# EAGLE design ZMinusSunSensorBoardAntennae (EAGLE 9.6.2)
DESIGNER: Thomas Christison; REV#: B; REVIEWER: ADCS Electrical

## Sheet 1 of 6
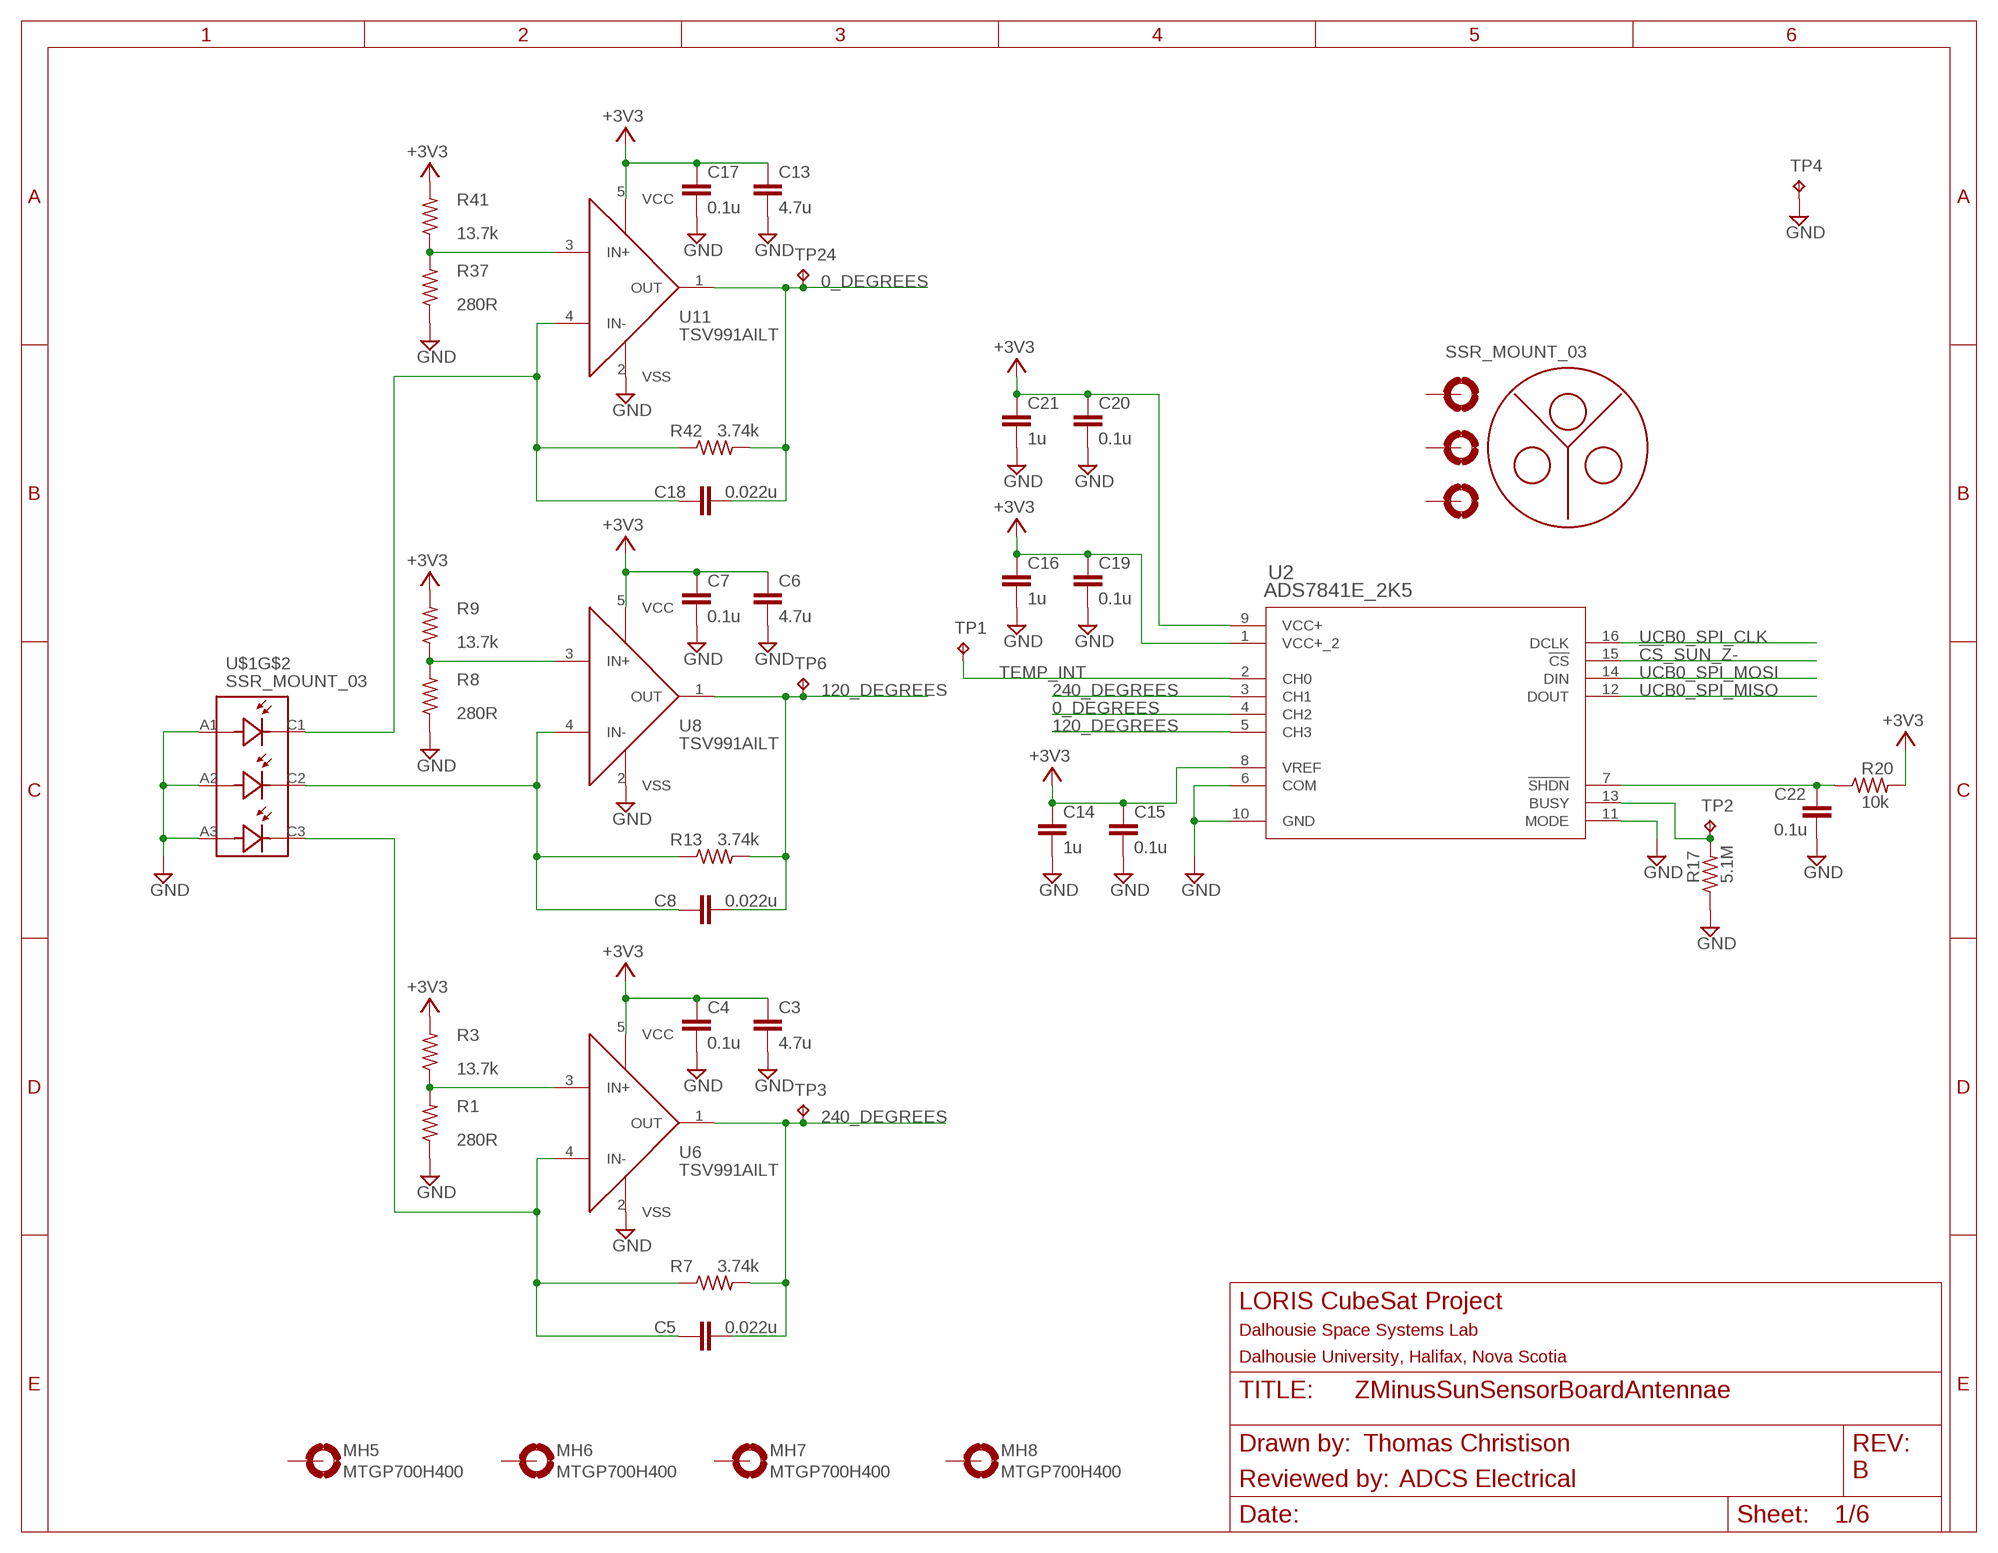
[diagram p0: schematic, sheet 1]

### Parts
C3  4.7u  C-EUC0805  [C0805]
C4  0.1u  C-EUC0402  [C0402]
C5  0.022u  C-EUC0402  [C0402]
C6  4.7u  C-EUC0805  [C0805]
C7  0.1u  C-EUC0402  [C0402]
C8  0.022u  C-EUC0402  [C0402]
C13  4.7u  C-EUC0805  [C0805]
C14  1u  C-EUC0402  [C0402]
C15  0.1u  C-EUC0402  [C0402]
C16  1u  C-EUC0402  [C0402]
C17  0.1u  C-EUC0402  [C0402]
C18  0.022u  C-EUC0402  [C0402]
C19  0.1u  C-EUC0402  [C0402]
C20  0.1u  C-EUC0402  [C0402]
C21  1u  C-EUC0402  [C0402]
C22  0.1u  C-EUC0402  [C0402]
MH5  MTGP700H400  [MTGP700H400]
MH6  MTGP700H400  [MTGP700H400]
MH7  MTGP700H400  [MTGP700H400]
MH8  MTGP700H400  [MTGP700H400]
R1  280R  R-US_R0402  [R0402]
R3  13.7k  R-US_R0402  [R0402]
R7  3.74k  R-US_R0402  [R0402]
R8  280R  R-US_R0402  [R0402]
R9  13.7k  R-US_R0402  [R0402]
R13  3.74k  R-US_R0402  [R0402]
R17  5.1M  R-US_R0402  [R0402]
R20  10k  R-US_R0402  [R0402]
R37  280R  R-US_R0402  [R0402]
R41  13.7k  R-US_R0402  [R0402]
R42  3.74k  R-US_R0402  [R0402]
TP1  TESTPOINT  [TP_P76H50]
TP2  TESTPOINT  [TP_P76H50]
TP3  TESTPOINT  [TP_P76H50]
TP4  TESTPOINT  [TP_P76H50]
TP6  TESTPOINT  [TP_P76H50]
TP24  TESTPOINT  [TP_P76H50]
U2  ADS7841E_2K5  [DBQ16]
U6  TSV991AILT  [SOT95P280X145-5N]
U8  TSV991AILT  [SOT95P280X145-5N]
U11  TSV991AILT  [SOT95P280X145-5N]
U$1  SSR_MOUNT_03  [SSR_MOUNT_03]

### Nets
0_DEGREES: C18.2 R42.2 TP24.1(TP) U2.4(CH2) U11.1(OUT)
120_DEGREES: C8.2 R13.2 TP6.1(TP) U2.5(CH3) U8.1(OUT)
240_DEGREES: C5.2 R7.2 TP3.1(TP) U2.3(CH1) U6.1(OUT)
!CS!_SUN_Z-: U2.15(!CS) ; also sheet 2
+3V3: C3.1 C4.1 C6.1 C7.1 C13.1 C14.1 C15.1 C16.1 C17.1 C19.1 C20.1 C21.1 R3.2 R9.2 R20.2 R41.2 U2.1(VCC+_2) U2.8(VREF) U2.9(VCC+) U6.5(VCC) U8.5(VCC) U11.5(VCC) ; also sheet 2,3,4,5,6
GND: C3.2 C4.2 C6.2 C7.2 C13.2 C14.2 C15.2 C16.2 C17.2 C19.2 C20.2 C21.2 C22.2 R1.1 R8.1 R17.1 R37.1 TP4.1(TP) U2.6(COM) U2.10(GND) U2.11(MODE) U6.2(VSS) U8.2(VSS) U11.2(VSS) U$1.A1 U$1.A2 U$1.A3 ; also sheet 2,3,4,5,6
N$2: R17.2 TP2.1(TP) U2.13(BUSY)
N$8: R1.2 R3.1 U6.3(IN+)
N$12: C5.1 R7.1 U6.4(IN-) U$1.C3
N$15: C22.1 R20.1 U2.7(!SHDN)
N$27: C8.1 R13.1 U8.4(IN-) U$1.C2
N$28: R8.2 R9.1 U8.3(IN+)
N$42: C18.1 R42.1 U11.4(IN-) U$1.C1
N$43: R37.2 R41.1 U11.3(IN+)
TEMP_INT: TP1.1(TP) U2.2(CH0) ; also sheet 2
UCB0_SPI_CLK: U2.16(DCLK) ; also sheet 2,3,4,5,6
UCB0_SPI_MISO: U2.12(DOUT) ; also sheet 2,3,4,5,6
UCB0_SPI_MOSI: U2.14(DIN) ; also sheet 2,3,4,5,6
Unconnected: MH5.1(MOUNT) MH6.1(MOUNT) MH7.1(MOUNT) MH8.1(MOUNT) U$1.1(MOUNT) U$1.2(MOUNT1) U$1.3(MOUNT2)

### Notes on the sheet
- Thomas Christison
- B
- ADCS Electrical

## Sheet 2 of 6
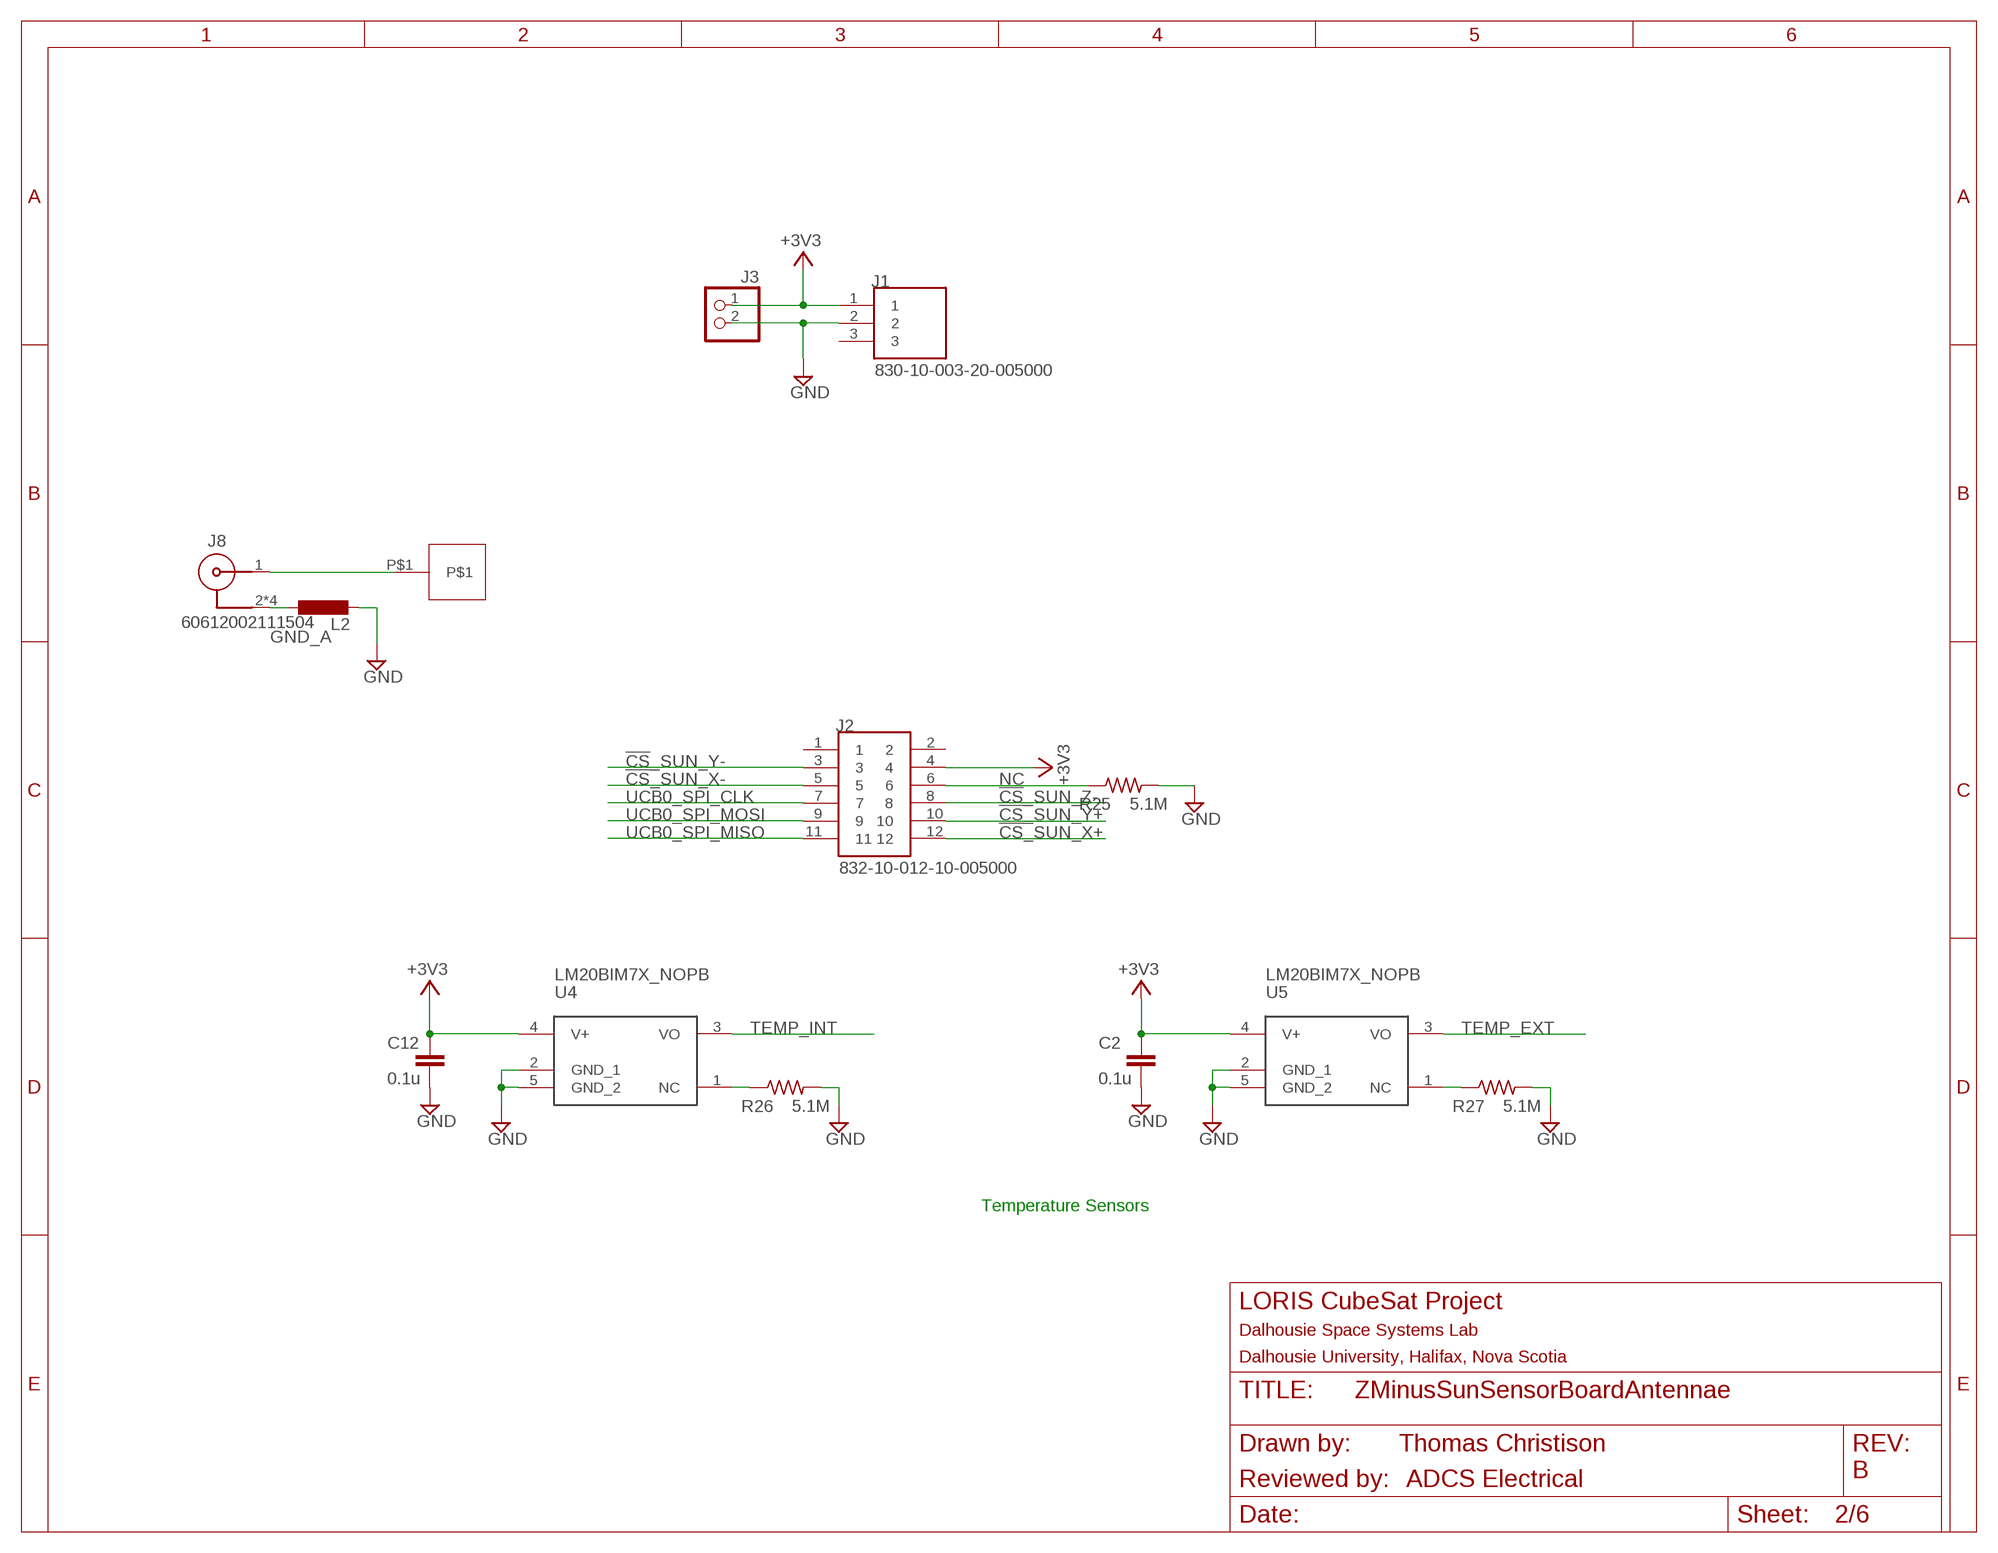
[diagram p1: schematic, sheet 2]

### Parts
C2  0.1u  C-EUC0402  [C0402]
C12  0.1u  C-EUC0402  [C0402]
J1  830-10-003-20-005000  [830-10-003-20-005000]
J2  832-10-012-10-005000  [832-10-012-10-005000]
J3  HDR_1X2_  [1X02]
J8  60612002111504  [60612002111504]
L2  L-EUL5650M  [L5650M]
R25  5.1M  R-US_R0402  [R0402]
R26  5.1M  R-US_R0402  [R0402]
R27  5.1M  R-US_R0402  [R0402]
U4  LM20BIM7X_NOPB  [SOT23-5P65_210X110L40X22N_LM20]
U5  LM20BIM7X_NOPB  [SOT23-5P65_210X110L40X22N_LM20]
U$2  2088900001  [2088900001]

### Nets
!CS!_SUN_X+: J2.12 ; also sheet 3
!CS!_SUN_X-: J2.5 ; also sheet 4
!CS!_SUN_Y+: J2.10 ; also sheet 5
!CS!_SUN_Y-: J2.3 ; also sheet 6
!CS!_SUN_Z-: J2.8 ; also sheet 1
+3V3: C2.1 C12.1 J1.1 J2.4 J3.1 U4.4(V+) U5.4(V+) ; also sheet 1,3,4,5,6
GND: C2.2 C12.2 J1.2 J3.2 L2.2 R25.2 R26.2 R27.2 U4.2(GND_1) U4.5(GND_2) U5.2(GND_1) U5.5(GND_2) ; also sheet 1,3,4,5,6
GND_A: J8.2 J8.3 J8.4 J8.5 L2.1
N$7: R26.1 U4.1(NC)
N$18: J8.1 U$2.P$1
N$20: R27.1 U5.1(NC)
N$67: J2.6 R25.1
TEMP_EXT: U5.3(VO) ; also sheet 3
TEMP_INT: U4.3(VO) ; also sheet 1
UCB0_SPI_CLK: J2.7 ; also sheet 1,3,4,5,6
UCB0_SPI_MISO: J2.11 ; also sheet 1,3,4,5,6
UCB0_SPI_MOSI: J2.9 ; also sheet 1,3,4,5,6
Unconnected: J1.3 J2.1 J2.2

### Notes on the sheet
- NC
- Temperature Sensors
- ADCS Electrical

## Sheet 3 of 6
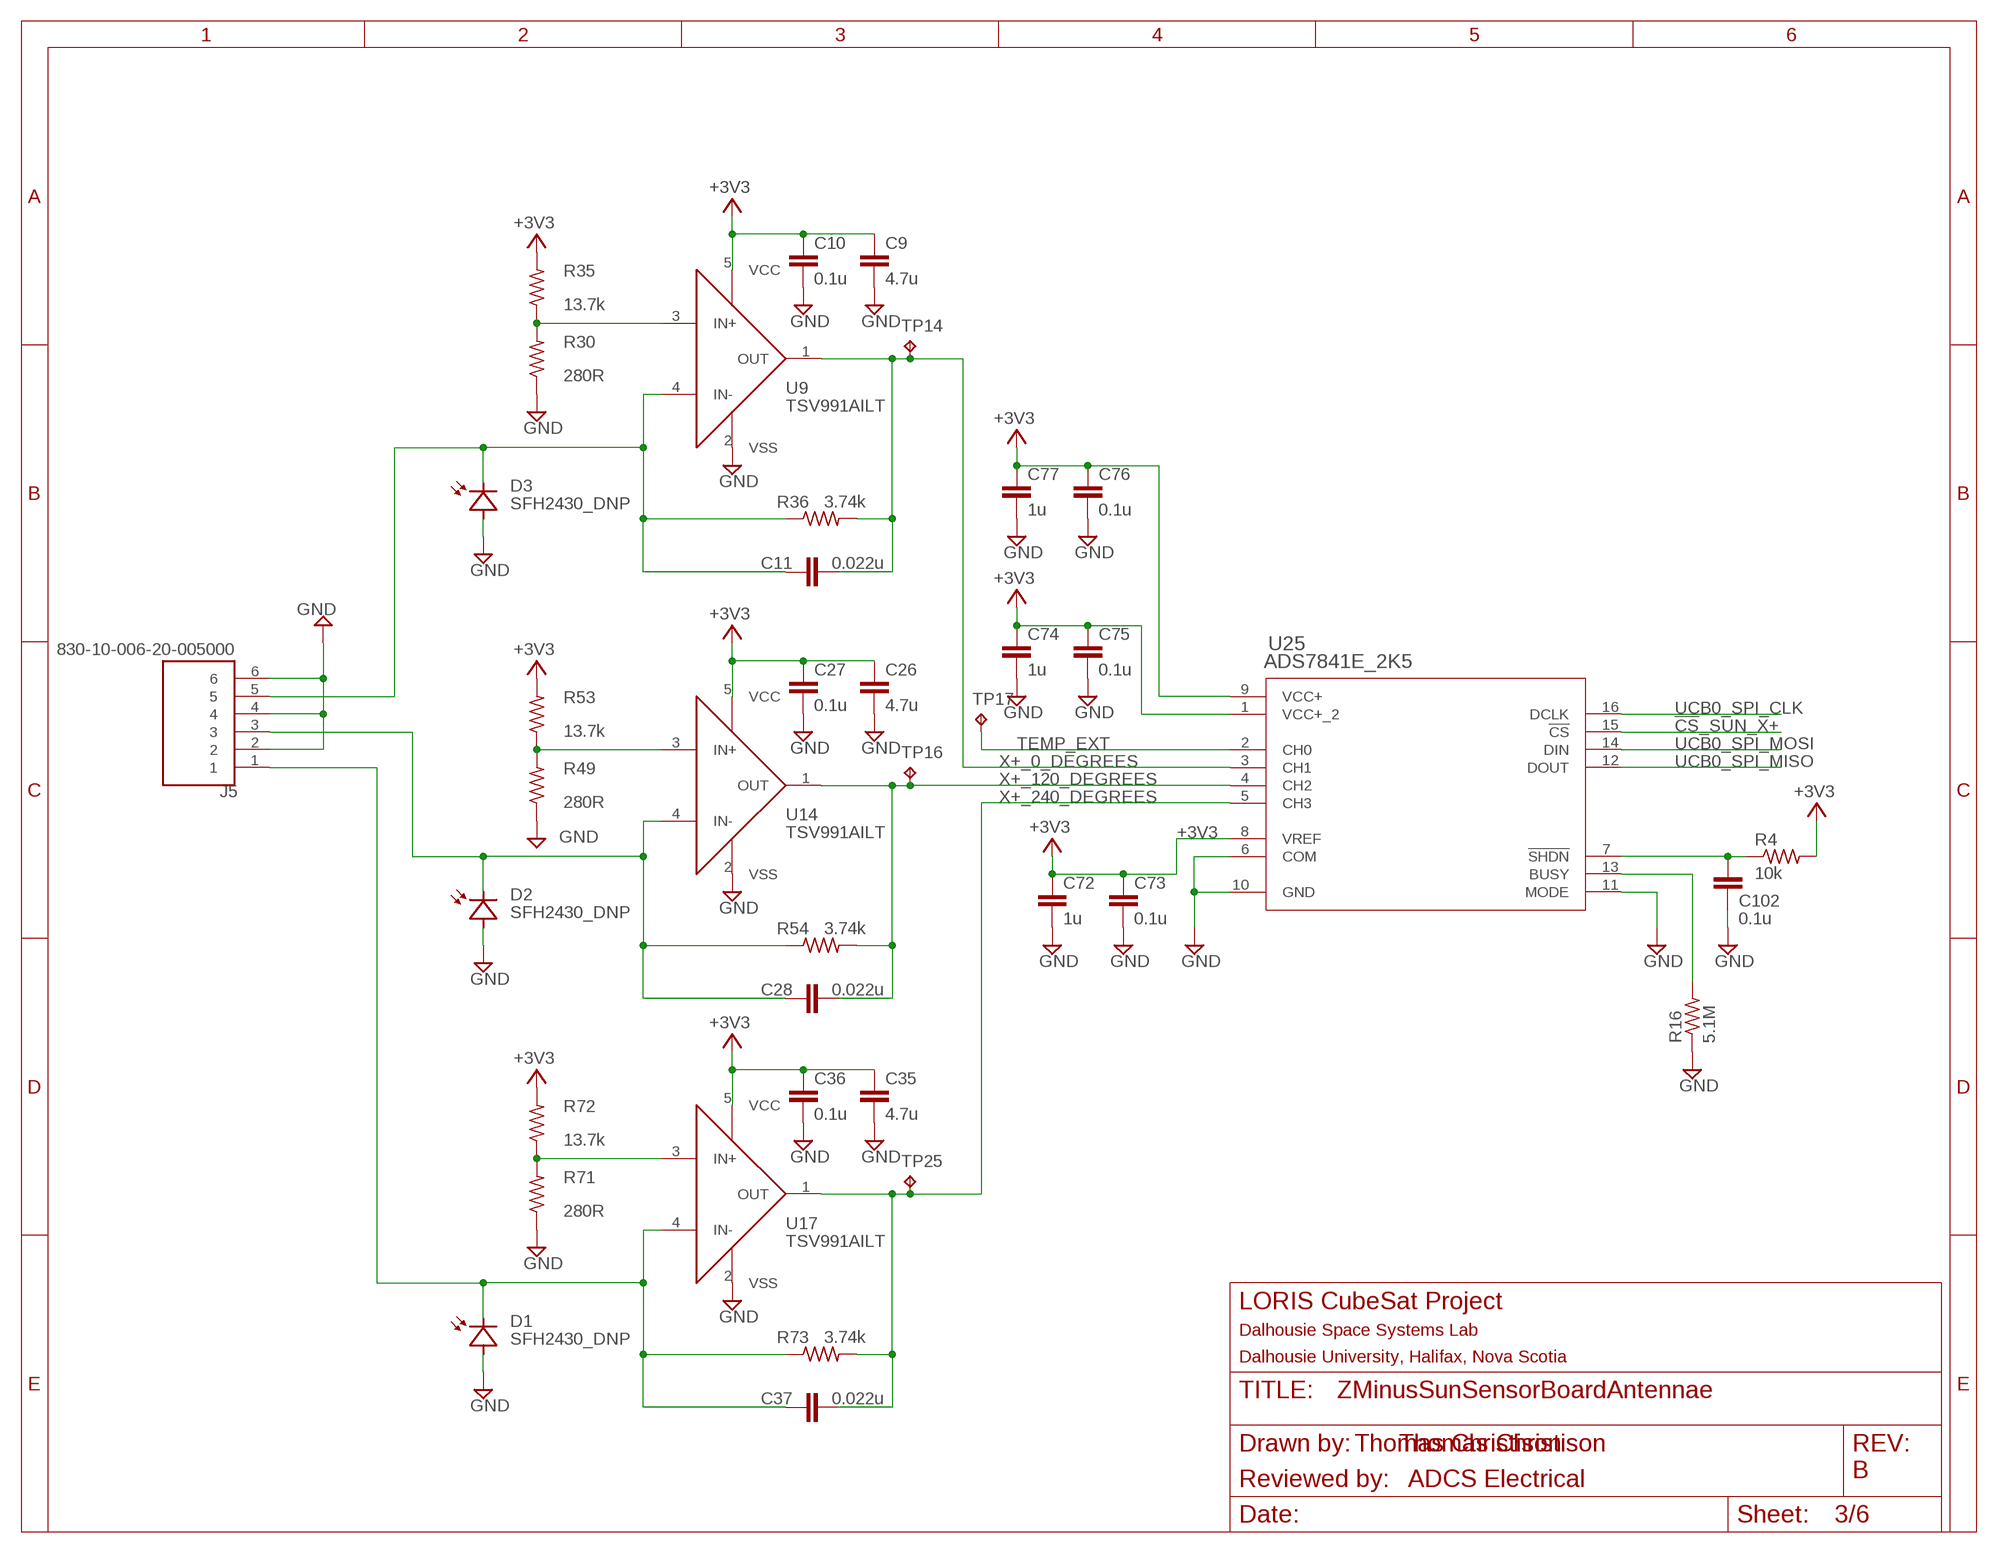
[diagram p2: schematic, sheet 3]

### Parts
C9  4.7u  C-EUC0805  [C0805]
C10  0.1u  C-EUC0402  [C0402]
C11  0.022u  C-EUC0402  [C0402]
C26  4.7u  C-EUC0805  [C0805]
C27  0.1u  C-EUC0402  [C0402]
C28  0.022u  C-EUC0402  [C0402]
C35  4.7u  C-EUC0805  [C0805]
C36  0.1u  C-EUC0402  [C0402]
C37  0.022u  C-EUC0402  [C0402]
C72  1u  C-EUC0402  [C0402]
C73  0.1u  C-EUC0402  [C0402]
C74  1u  C-EUC0402  [C0402]
C75  0.1u  C-EUC0402  [C0402]
C76  0.1u  C-EUC0402  [C0402]
C77  1u  C-EUC0402  [C0402]
C102  0.1u  C-EUC0402  [C0402]
J5  830-10-006-20-005000  [830-10-006-20-005000]
R4  10k  R-US_R0402  [R0402]
R16  5.1M  R-US_R0402  [R0402]
R30  280R  R-US_R0402  [R0402]
R35  13.7k  R-US_R0402  [R0402]
R36  3.74k  R-US_R0402  [R0402]
R49  280R  R-US_R0402  [R0402]
R53  13.7k  R-US_R0402  [R0402]
R54  3.74k  R-US_R0402  [R0402]
R71  280R  R-US_R0402  [R0402]
R72  13.7k  R-US_R0402  [R0402]
R73  3.74k  R-US_R0402  [R0402]
TP14  TESTPOINT  [TP_P76H50]
TP16  TESTPOINT  [TP_P76H50]
TP17  TESTPOINT  [TP_P76H50]
TP25  TESTPOINT  [TP_P76H50]
U9  TSV991AILT  [SOT95P280X145-5N]
U14  TSV991AILT  [SOT95P280X145-5N]
U17  TSV991AILT  [SOT95P280X145-5N]
U25  ADS7841E_2K5  [DBQ16]

### Nets
!CS!_SUN_X+: U25.15(!CS) ; also sheet 2
+3V3: C9.1 C10.1 C26.1 C27.1 C35.1 C36.1 C72.1 C73.1 C74.1 C75.1 C76.1 C77.1 R4.2 R35.2 R53.2 R72.2 U9.5(VCC) U14.5(VCC) U17.5(VCC) U25.1(VCC+_2) U25.8(VREF) U25.9(VCC+) ; also sheet 1,2,4,5,6
GND: C9.2 C10.2 C26.2 C27.2 C35.2 C36.2 C72.2 C73.2 C74.2 C75.2 C76.2 C77.2 C102.2 J5.2 J5.4 J5.6 R16.1 R30.1 R49.1 R71.1 U9.2(VSS) U14.2(VSS) U17.2(VSS) U25.6(COM) U25.10(GND) U25.11(MODE) ; also sheet 1,2,4,5,6
N$4: C102.1 R4.1 U25.7(!SHDN)
N$40: R30.2 R35.1 U9.3(IN+)
N$49: C11.1 J5.5 R36.1 U9.4(IN-)
N$51: R16.2 U25.13(BUSY)
N$55: C28.1 J5.3 R54.1 U14.4(IN-)
N$57: C37.1 J5.1 R73.1 U17.4(IN-)
N$60: R49.2 R53.1 U14.3(IN+)
N$71: R71.2 R72.1 U17.3(IN+)
TEMP_EXT: TP17.1(TP) U25.2(CH0) ; also sheet 2
UCB0_SPI_CLK: U25.16(DCLK) ; also sheet 1,2,4,5,6
UCB0_SPI_MISO: U25.12(DOUT) ; also sheet 1,2,4,5,6
UCB0_SPI_MOSI: U25.14(DIN) ; also sheet 1,2,4,5,6
X+_0_DEGREES: C11.2 R36.2 TP14.1(TP) U9.1(OUT) U25.3(CH1)
X+_120_DEGREES: C28.2 R54.2 TP16.1(TP) U14.1(OUT) U25.4(CH2)
X+_240_DEGREES: C37.2 R73.2 TP25.1(TP) U17.1(OUT) U25.5(CH3)

### Notes on the sheet
- Thomas Christison
- B
- ADCS Electrical

## Sheet 4 of 6
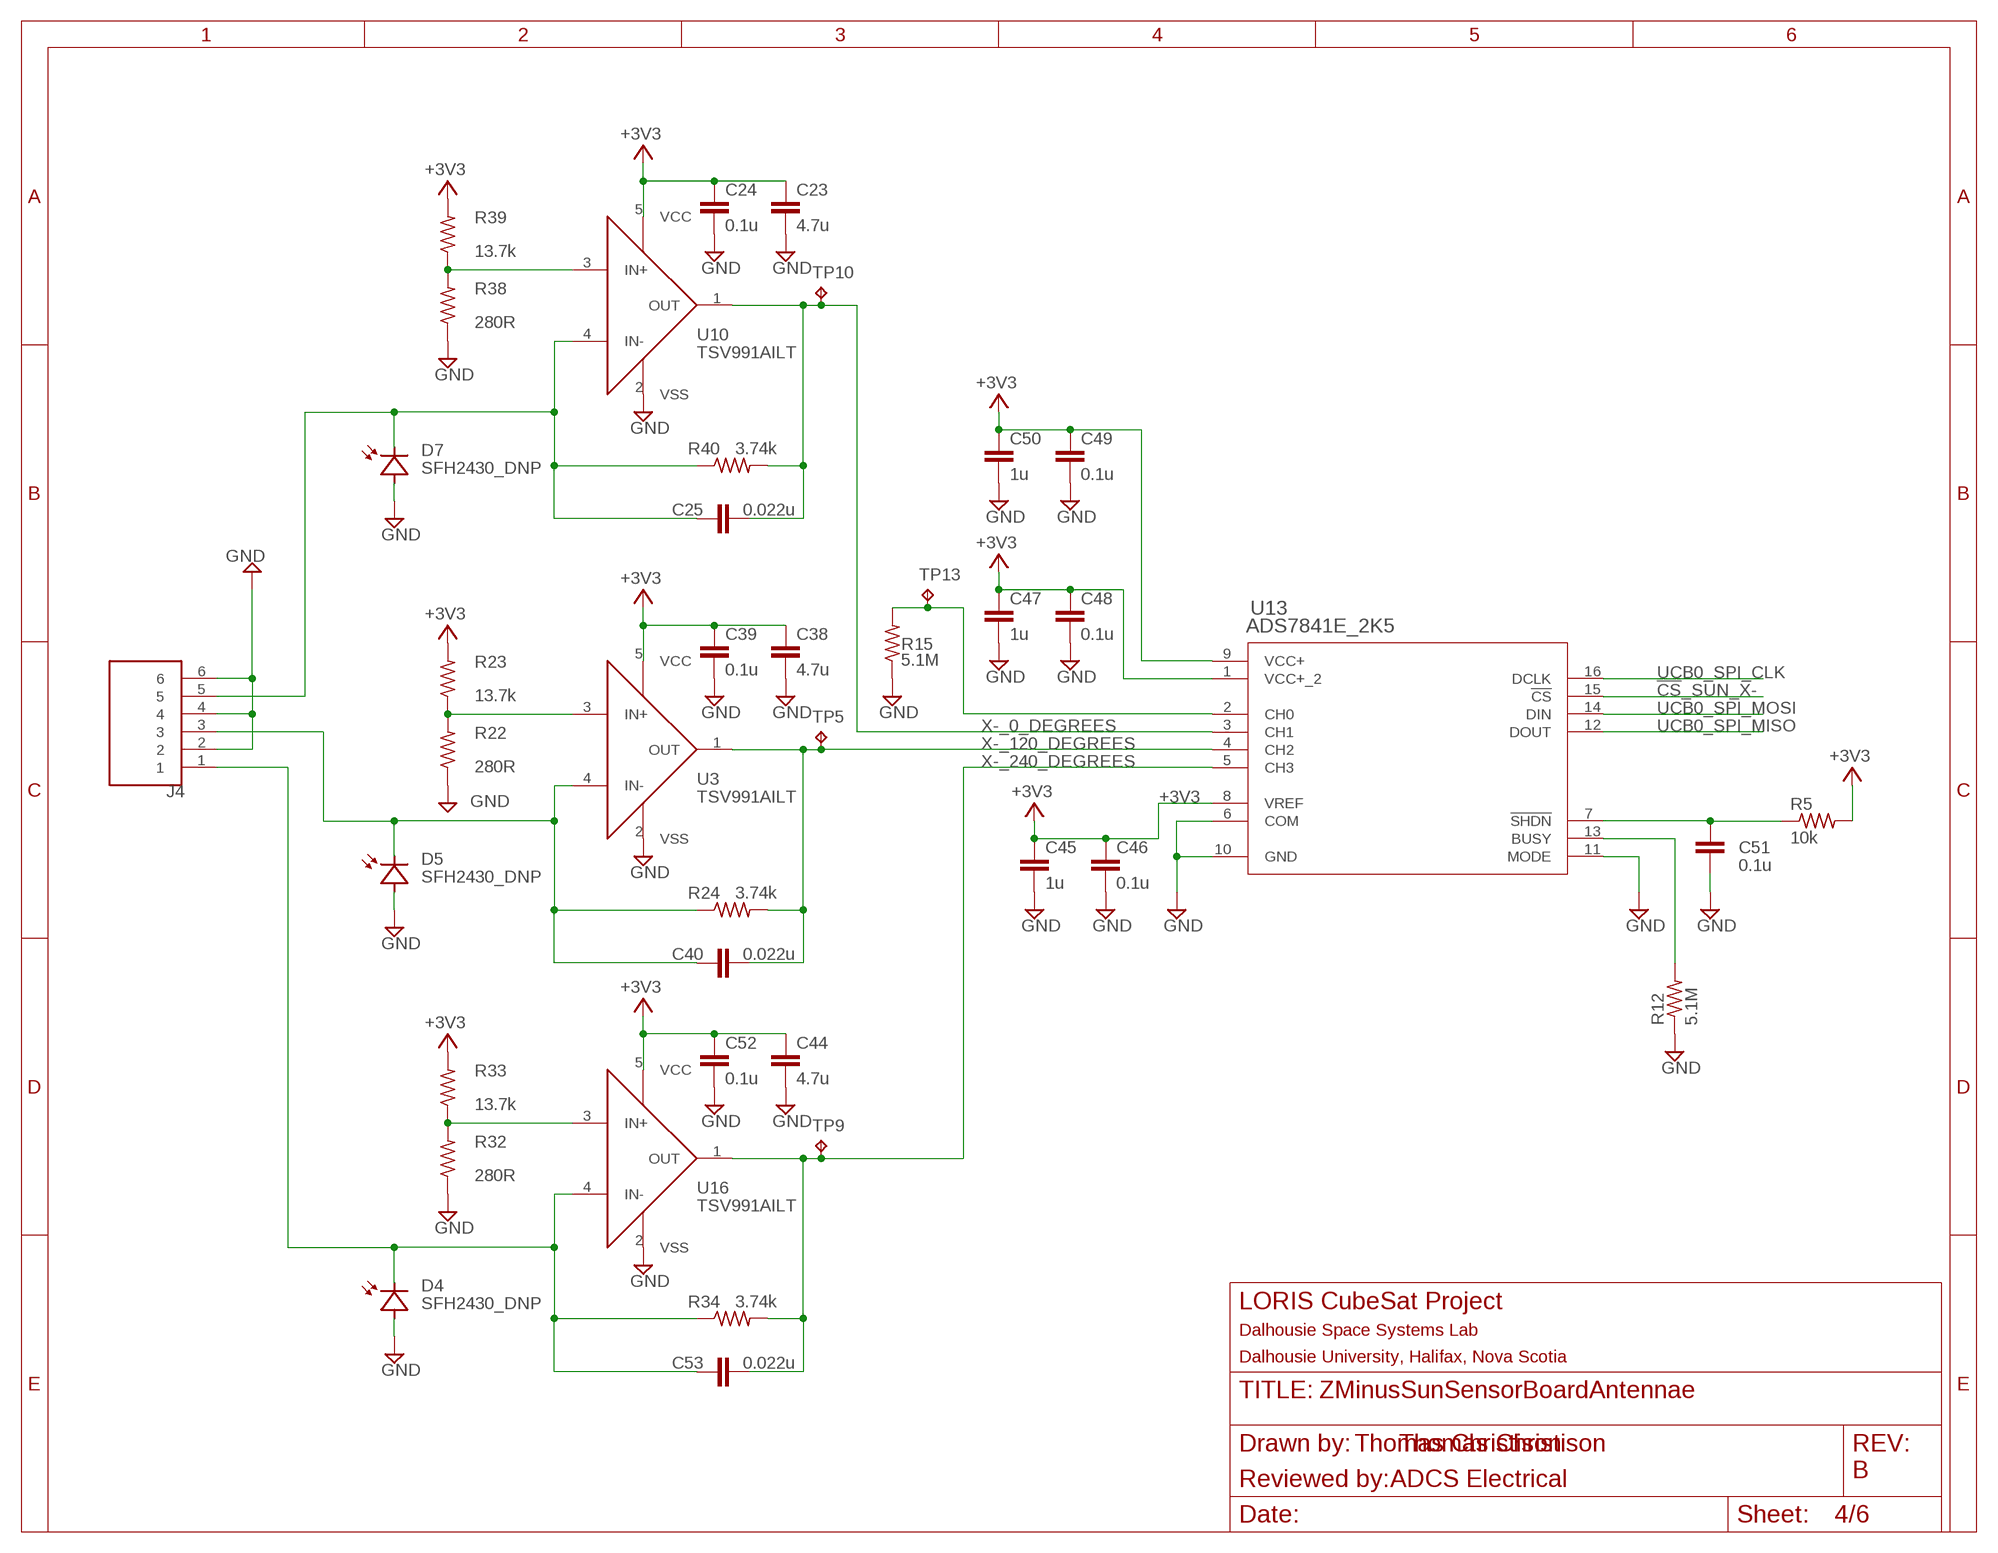
[diagram p3: schematic, sheet 4]

### Parts
C23  4.7u  C-EUC0805  [C0805]
C24  0.1u  C-EUC0402  [C0402]
C25  0.022u  C-EUC0402  [C0402]
C38  4.7u  C-EUC0805  [C0805]
C39  0.1u  C-EUC0402  [C0402]
C40  0.022u  C-EUC0402  [C0402]
C44  4.7u  C-EUC0805  [C0805]
C45  1u  C-EUC0402  [C0402]
C46  0.1u  C-EUC0402  [C0402]
C47  1u  C-EUC0402  [C0402]
C48  0.1u  C-EUC0402  [C0402]
C49  0.1u  C-EUC0402  [C0402]
C50  1u  C-EUC0402  [C0402]
C51  0.1u  C-EUC0402  [C0402]
C52  0.1u  C-EUC0402  [C0402]
C53  0.022u  C-EUC0402  [C0402]
J4  830-10-006-20-005000  [830-10-006-20-005000]
R5  10k  R-US_R0402  [R0402]
R12  5.1M  R-US_R0402  [R0402]
R15  5.1M  R-US_R0402  [R0402]
R22  280R  R-US_R0402  [R0402]
R23  13.7k  R-US_R0402  [R0402]
R24  3.74k  R-US_R0402  [R0402]
R32  280R  R-US_R0402  [R0402]
R33  13.7k  R-US_R0402  [R0402]
R34  3.74k  R-US_R0402  [R0402]
R38  280R  R-US_R0402  [R0402]
R39  13.7k  R-US_R0402  [R0402]
R40  3.74k  R-US_R0402  [R0402]
TP5  TESTPOINT  [TP_P76H50]
TP9  TESTPOINT  [TP_P76H50]
TP10  TESTPOINT  [TP_P76H50]
TP13  TESTPOINT  [TP_P76H50]
U3  TSV991AILT  [SOT95P280X145-5N]
U10  TSV991AILT  [SOT95P280X145-5N]
U13  ADS7841E_2K5  [DBQ16]
U16  TSV991AILT  [SOT95P280X145-5N]

### Nets
!CS!_SUN_X-: U13.15(!CS) ; also sheet 2
+3V3: C23.1 C24.1 C38.1 C39.1 C44.1 C45.1 C46.1 C47.1 C48.1 C49.1 C50.1 C52.1 R5.2 R23.2 R33.2 R39.2 U3.5(VCC) U10.5(VCC) U13.1(VCC+_2) U13.8(VREF) U13.9(VCC+) U16.5(VCC) ; also sheet 1,2,3,5,6
GND: C23.2 C24.2 C38.2 C39.2 C44.2 C45.2 C46.2 C47.2 C48.2 C49.2 C50.2 C51.2 C52.2 J4.2 J4.4 J4.6 R12.1 R15.1 R22.1 R32.1 R38.1 U3.2(VSS) U10.2(VSS) U13.6(COM) U13.10(GND) U13.11(MODE) U16.2(VSS) ; also sheet 1,2,3,5,6
N$6: R38.2 R39.1 U10.3(IN+)
N$10: R15.2 TP13.1(TP) U13.2(CH0)
N$22: C51.1 R5.1 U13.7(!SHDN)
N$32: R22.2 R23.1 U3.3(IN+)
N$38: C25.1 J4.5 R40.1 U10.4(IN-)
N$41: R32.2 R33.1 U16.3(IN+)
N$44: C40.1 J4.3 R24.1 U3.4(IN-)
N$46: C53.1 J4.1 R34.1 U16.4(IN-)
N$50: R12.2 U13.13(BUSY)
UCB0_SPI_CLK: U13.16(DCLK) ; also sheet 1,2,3,5,6
UCB0_SPI_MISO: U13.12(DOUT) ; also sheet 1,2,3,5,6
UCB0_SPI_MOSI: U13.14(DIN) ; also sheet 1,2,3,5,6
X-_0_DEGREES: C25.2 R40.2 TP10.1(TP) U10.1(OUT) U13.3(CH1)
X-_120_DEGREES: C40.2 R24.2 TP5.1(TP) U3.1(OUT) U13.4(CH2)
X-_240_DEGREES: C53.2 R34.2 TP9.1(TP) U13.5(CH3) U16.1(OUT)

### Notes on the sheet
- Thomas Christison
- B
- ADCS Electrical

## Sheet 5 of 6
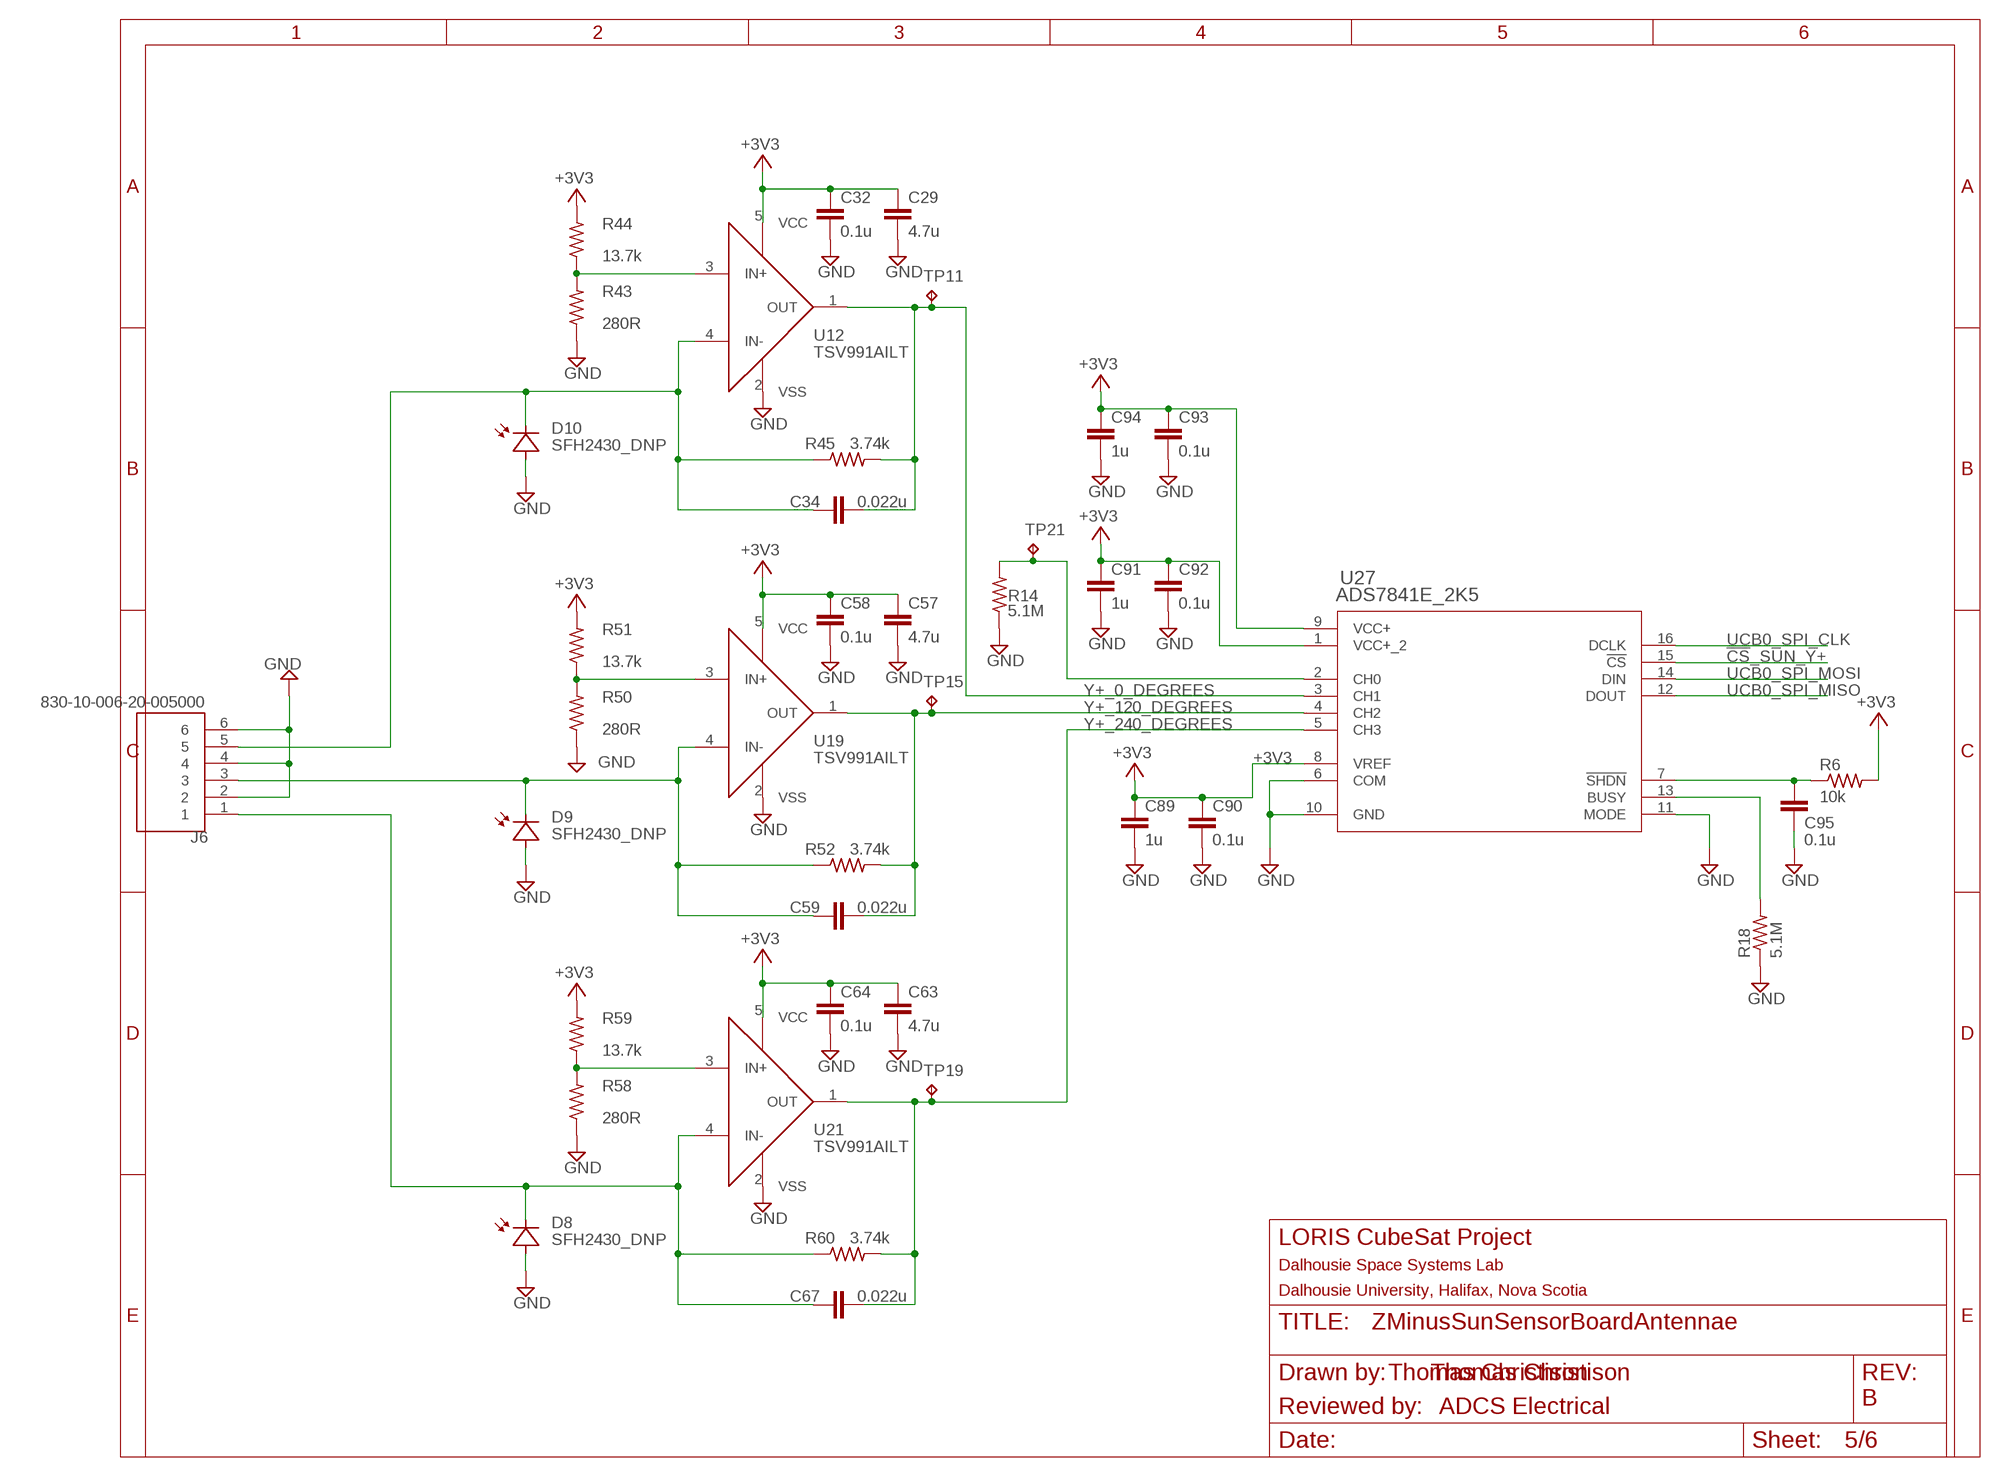
[diagram p4: schematic, sheet 5]

### Parts
C29  4.7u  C-EUC0805  [C0805]
C32  0.1u  C-EUC0402  [C0402]
C34  0.022u  C-EUC0402  [C0402]
C57  4.7u  C-EUC0805  [C0805]
C58  0.1u  C-EUC0402  [C0402]
C59  0.022u  C-EUC0402  [C0402]
C63  4.7u  C-EUC0805  [C0805]
C64  0.1u  C-EUC0402  [C0402]
C67  0.022u  C-EUC0402  [C0402]
C89  1u  C-EUC0402  [C0402]
C90  0.1u  C-EUC0402  [C0402]
C91  1u  C-EUC0402  [C0402]
C92  0.1u  C-EUC0402  [C0402]
C93  0.1u  C-EUC0402  [C0402]
C94  1u  C-EUC0402  [C0402]
C95  0.1u  C-EUC0402  [C0402]
J6  830-10-006-20-005000  [830-10-006-20-005000]
R6  10k  R-US_R0402  [R0402]
R14  5.1M  R-US_R0402  [R0402]
R18  5.1M  R-US_R0402  [R0402]
R43  280R  R-US_R0402  [R0402]
R44  13.7k  R-US_R0402  [R0402]
R45  3.74k  R-US_R0402  [R0402]
R50  280R  R-US_R0402  [R0402]
R51  13.7k  R-US_R0402  [R0402]
R52  3.74k  R-US_R0402  [R0402]
R58  280R  R-US_R0402  [R0402]
R59  13.7k  R-US_R0402  [R0402]
R60  3.74k  R-US_R0402  [R0402]
TP11  TESTPOINT  [TP_P76H50]
TP15  TESTPOINT  [TP_P76H50]
TP19  TESTPOINT  [TP_P76H50]
TP21  TESTPOINT  [TP_P76H50]
U12  TSV991AILT  [SOT95P280X145-5N]
U19  TSV991AILT  [SOT95P280X145-5N]
U21  TSV991AILT  [SOT95P280X145-5N]
U27  ADS7841E_2K5  [DBQ16]

### Nets
!CS!_SUN_Y+: U27.15(!CS) ; also sheet 2
+3V3: C29.1 C32.1 C57.1 C58.1 C63.1 C64.1 C89.1 C90.1 C91.1 C92.1 C93.1 C94.1 R6.2 R44.2 R51.2 R59.2 U12.5(VCC) U19.5(VCC) U21.5(VCC) U27.1(VCC+_2) U27.8(VREF) U27.9(VCC+) ; also sheet 1,2,3,4,6
GND: C29.2 C32.2 C57.2 C58.2 C63.2 C64.2 C89.2 C90.2 C91.2 C92.2 C93.2 C94.2 C95.2 J6.2 J6.4 J6.6 R14.1 R18.1 R43.1 R50.1 R58.1 U12.2(VSS) U19.2(VSS) U21.2(VSS) U27.6(COM) U27.10(GND) U27.11(MODE) ; also sheet 1,2,3,4,6
N$3: C34.1 J6.5 R45.1 U12.4(IN-)
N$5: C59.1 J6.3 R52.1 U19.4(IN-)
N$11: R14.2 TP21.1(TP) U27.2(CH0)
N$25: C95.1 R6.1 U27.7(!SHDN)
N$30: R43.2 R44.1 U12.3(IN+)
N$52: R18.2 U27.13(BUSY)
N$54: R50.2 R51.1 U19.3(IN+)
N$61: R58.2 R59.1 U21.3(IN+)
N$65: C67.1 J6.1 R60.1 U21.4(IN-)
UCB0_SPI_CLK: U27.16(DCLK) ; also sheet 1,2,3,4,6
UCB0_SPI_MISO: U27.12(DOUT) ; also sheet 1,2,3,4,6
UCB0_SPI_MOSI: U27.14(DIN) ; also sheet 1,2,3,4,6
Y+_0_DEGREES: C34.2 R45.2 TP11.1(TP) U12.1(OUT) U27.3(CH1)
Y+_120_DEGREES: C59.2 R52.2 TP15.1(TP) U19.1(OUT) U27.4(CH2)
Y+_240_DEGREES: C67.2 R60.2 TP19.1(TP) U21.1(OUT) U27.5(CH3)

### Notes on the sheet
- Thomas Christison
- B
- ADCS Electrical

## Sheet 6 of 6
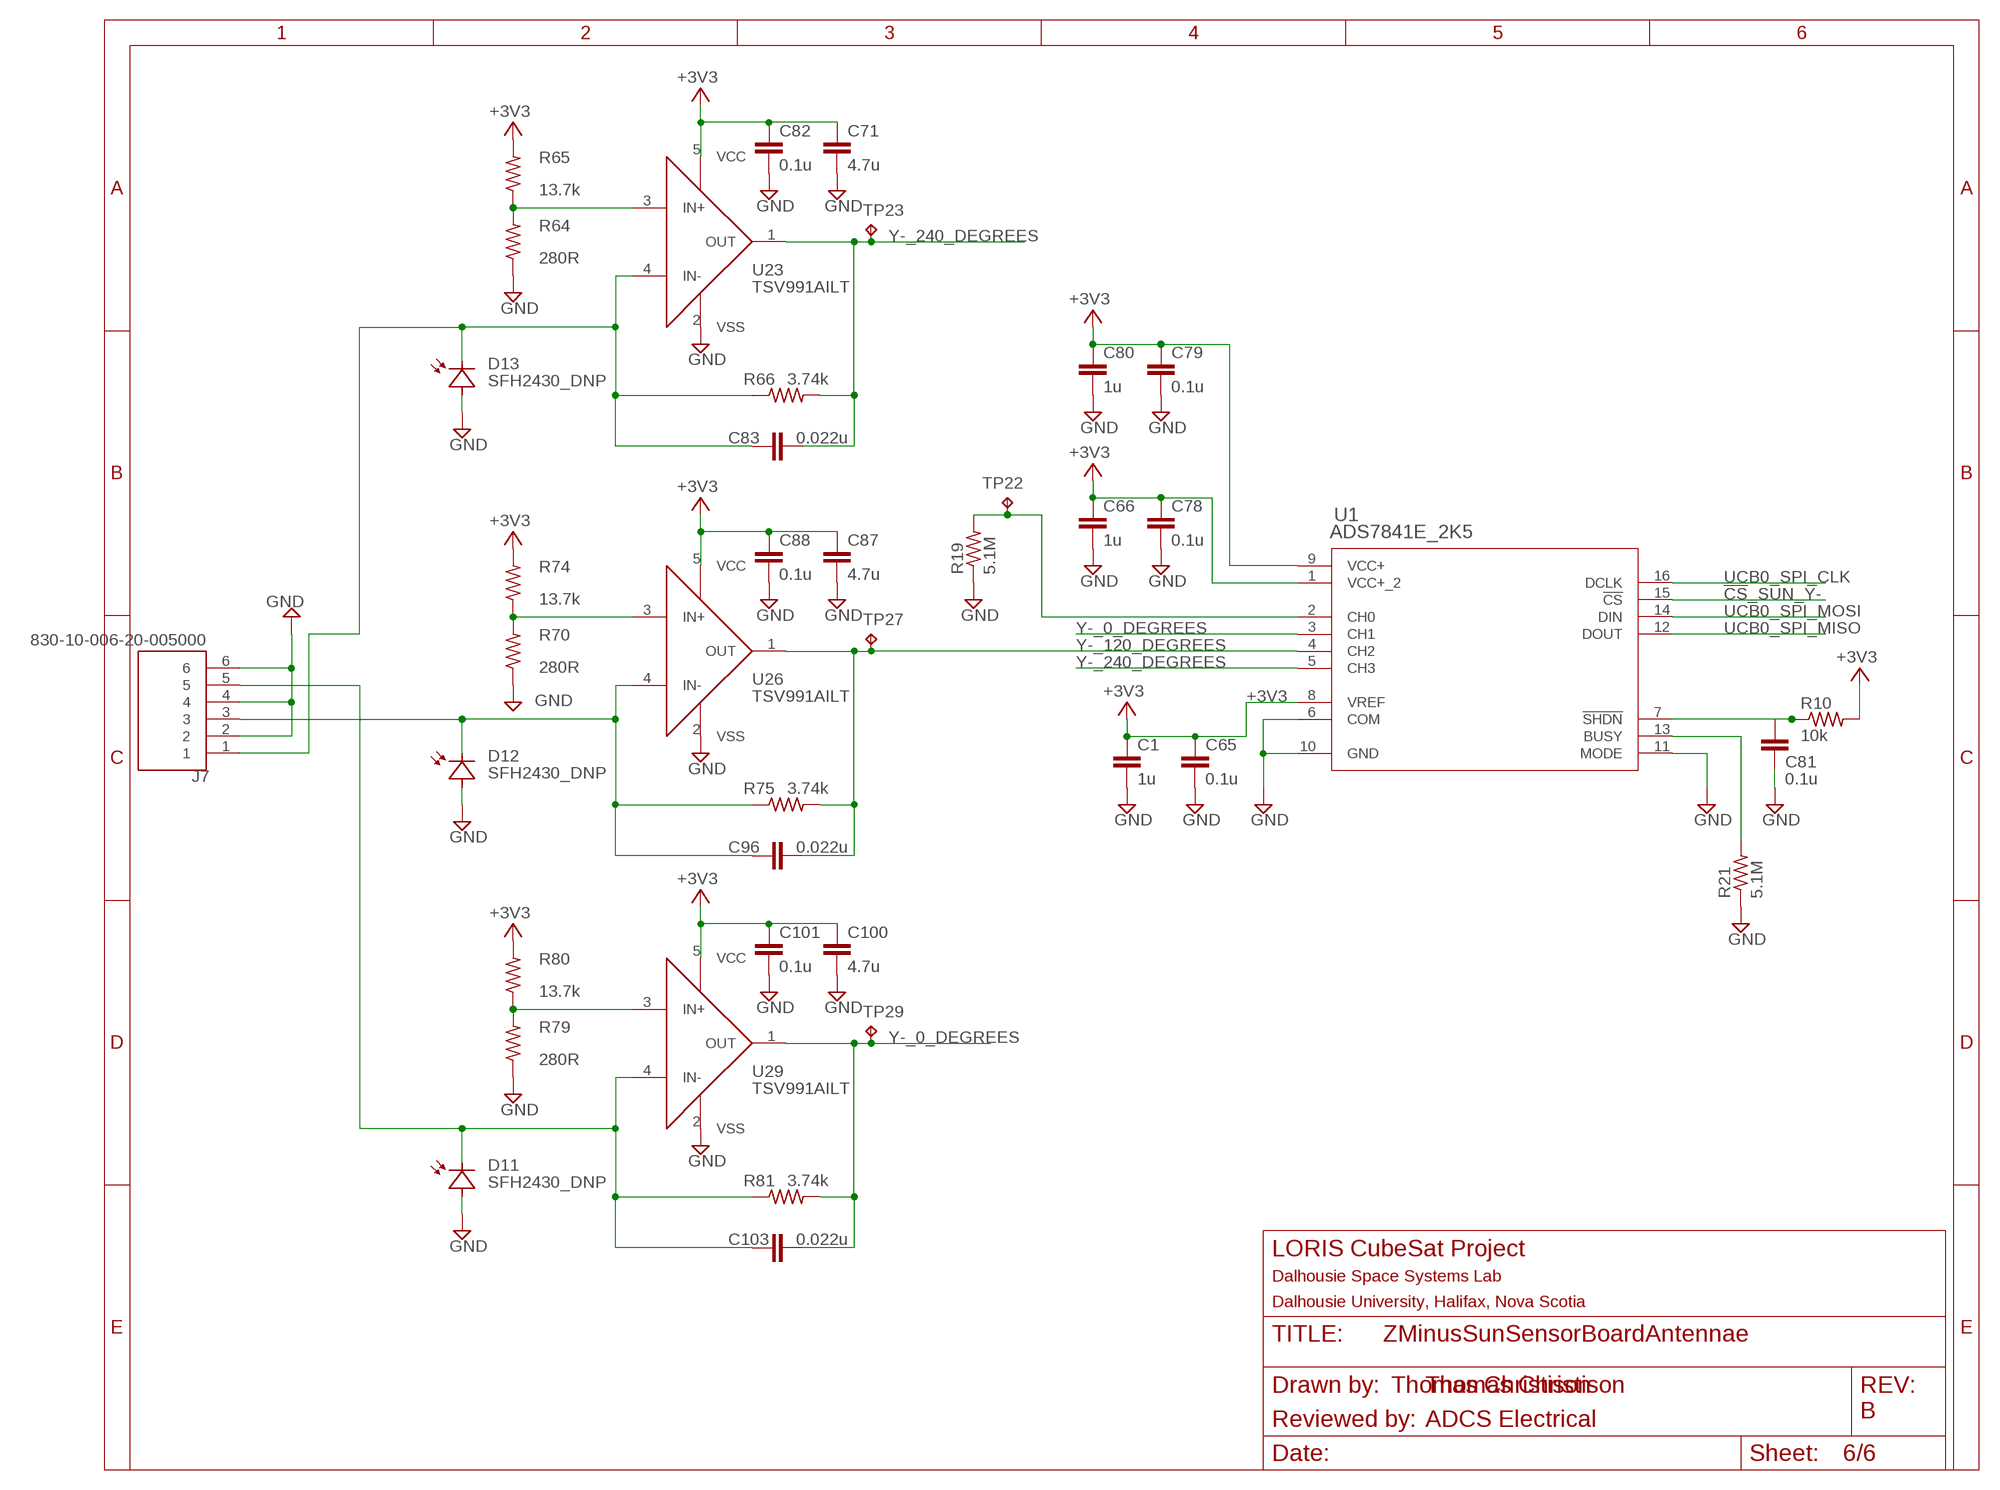
[diagram p5: schematic, sheet 6]

### Parts
C1  1u  C-EUC0402  [C0402]
C65  0.1u  C-EUC0402  [C0402]
C66  1u  C-EUC0402  [C0402]
C71  4.7u  C-EUC0805  [C0805]
C78  0.1u  C-EUC0402  [C0402]
C79  0.1u  C-EUC0402  [C0402]
C80  1u  C-EUC0402  [C0402]
C81  0.1u  C-EUC0402  [C0402]
C82  0.1u  C-EUC0402  [C0402]
C83  0.022u  C-EUC0402  [C0402]
C87  4.7u  C-EUC0805  [C0805]
C88  0.1u  C-EUC0402  [C0402]
C96  0.022u  C-EUC0402  [C0402]
C100  4.7u  C-EUC0805  [C0805]
C101  0.1u  C-EUC0402  [C0402]
C103  0.022u  C-EUC0402  [C0402]
J7  830-10-006-20-005000  [830-10-006-20-005000]
R10  10k  R-US_R0402  [R0402]
R19  5.1M  R-US_R0402  [R0402]
R21  5.1M  R-US_R0402  [R0402]
R64  280R  R-US_R0402  [R0402]
R65  13.7k  R-US_R0402  [R0402]
R66  3.74k  R-US_R0402  [R0402]
R70  280R  R-US_R0402  [R0402]
R74  13.7k  R-US_R0402  [R0402]
R75  3.74k  R-US_R0402  [R0402]
R79  280R  R-US_R0402  [R0402]
R80  13.7k  R-US_R0402  [R0402]
R81  3.74k  R-US_R0402  [R0402]
TP22  TESTPOINT  [TP_P76H50]
TP23  TESTPOINT  [TP_P76H50]
TP27  TESTPOINT  [TP_P76H50]
TP29  TESTPOINT  [TP_P76H50]
U1  ADS7841E_2K5  [DBQ16]
U23  TSV991AILT  [SOT95P280X145-5N]
U26  TSV991AILT  [SOT95P280X145-5N]
U29  TSV991AILT  [SOT95P280X145-5N]

### Nets
!CS!_SUN_Y-: U1.15(!CS) ; also sheet 2
+3V3: C1.1 C65.1 C66.1 C71.1 C78.1 C79.1 C80.1 C82.1 C87.1 C88.1 C100.1 C101.1 R10.2 R65.2 R74.2 R80.2 U1.1(VCC+_2) U1.8(VREF) U1.9(VCC+) U23.5(VCC) U26.5(VCC) U29.5(VCC) ; also sheet 1,2,3,4,5
GND: C1.2 C65.2 C66.2 C71.2 C78.2 C79.2 C80.2 C81.2 C82.2 C87.2 C88.2 C100.2 C101.2 J7.2 J7.4 J7.6 R19.1 R21.1 R64.1 R70.1 R79.1 U1.6(COM) U1.10(GND) U1.11(MODE) U23.2(VSS) U26.2(VSS) U29.2(VSS) ; also sheet 1,2,3,4,5
N$13: C96.1 J7.3 R75.1 U26.4(IN-)
N$14: R19.2 TP22.1(TP) U1.2(CH0)
N$17: C103.1 J7.5 R81.1 U29.4(IN-)
N$24: C81.1 R10.1 U1.7(!SHDN)
N$29: C83.1 J7.1 R66.1 U23.4(IN-)
N$53: R21.2 U1.13(BUSY)
N$69: R64.2 R65.1 U23.3(IN+)
N$74: R70.2 R74.1 U26.3(IN+)
N$78: R79.2 R80.1 U29.3(IN+)
UCB0_SPI_CLK: U1.16(DCLK) ; also sheet 1,2,3,4,5
UCB0_SPI_MISO: U1.12(DOUT) ; also sheet 1,2,3,4,5
UCB0_SPI_MOSI: U1.14(DIN) ; also sheet 1,2,3,4,5
Y-_0_DEGREES: C103.2 R81.2 TP29.1(TP) U1.3(CH1) U29.1(OUT)
Y-_120_DEGREES: C96.2 R75.2 TP27.1(TP) U1.4(CH2) U26.1(OUT)
Y-_240_DEGREES: C83.2 R66.2 TP23.1(TP) U1.5(CH3) U23.1(OUT)

### Notes on the sheet
- Thomas Christison
- B
- ADCS Electrical

## Library data of the parts
C1 C4 C5 C7 C8 C10 C11 C14-C22 C24 C25 C27 C28 C32 C34 C36 C37 C39 C40 C45-C53 C58 C59 C64-C67 C72-C83 C88-C96 C101-C103 = resistor:C-EU: CAPACITOR, European symbol
C2 C3 C6 C9 C12 C13 C23 C26 C29 C35 C38 C44 C57 C63 C71 C87 C100 = rcl:C-EU: CAPACITOR, European symbol; SPICEPREFIX: C
J1 = 830-10-003-20-005000:830-10-003-20-005000: Check prices <https://pricing.snapeda.com/parts/2355104-4/TE%20Connectivity/view-part?ref=eda>; AVAILABILITY: In Stock; COMMENT: 2355104-4; DESCRIPTION: Pin 4P,2MM,BRK HDR,SRVT,2.8,0.1AU,TB W/CAP 4 POS; MF: TE Connectivity; MP: 2355104-4; PACKAGE: None; PRICE: None; PURCHASE-URL: https://pricing.snapeda.com/search/part/2355104-4/?ref=eda
J2 = 832-10-012-10-005000:832-10-012-10-005000: Check prices <https://pricing.snapeda.com/parts/2355104-4/TE%20Connectivity/view-part?ref=eda>; AVAILABILITY: In Stock; COMMENT: 2355104-4; DESCRIPTION: Pin 4P,2MM,BRK HDR,SRVT,2.8,0.1AU,TB W/CAP 4 POS; MF: TE Connectivity; MP: 2355104-4; PACKAGE: None; PRICE: None; PURCHASE-URL: https://pricing.snapeda.com/search/part/2355104-4/?ref=eda
J3 = my_library:HDR_1X2: JUMPER
J4-J7 = 830-10-006-20-005000:830-10-006-20-005000: Check prices <https://pricing.snapeda.com/parts/2355104-4/TE%20Connectivity/view-part?ref=eda>; AVAILABILITY: In Stock; COMMENT: 2355104-4; DESCRIPTION: Pin 4P,2MM,BRK HDR,SRVT,2.8,0.1AU,TB W/CAP 4 POS; MF: TE Connectivity; MP: 2355104-4; PACKAGE: None; PRICE: None; PURCHASE-URL: https://pricing.snapeda.com/search/part/2355104-4/?ref=eda
J8 = 60612002111504:60612002111504: Straight Solder Leg 3.94mm MCX PCB THT Jack MATERIAL PROPERTIES Insulator Material PTFE Center Contact Material Beryllium Copper Center Contact Plating Gold, min. 0.076µm over Nickel Body Material Brass Body Plating Gold, min. 0.076µm over Nickel KIND PROPERTIES Interface IEC 61169-36 Connector Type MCX Gender Jack Orientation Type Straight GENERAL INFORMATION Operating Temperature -55 up to +155 °C ELECTRICAL PROPERTIES Impedance 50 Ω Frequency Range DC~6 GHz MECHANICAL PROPERTIES Mating Cycle 500 Cycles PACKAGINGPROPERTIES Qty. 180 <https://katalog.we-online.com/media/images/v2/o150614v209%20Family-WR-MCX_60612002111504.jpg> Details see: https://katalog.we-online.com/en/em/WR-MCX_60612002111504 Updated by Ella Wu 2019-11-04 2019 (C) Würth Elektronik Check prices <https://pricing.snapeda.com/parts/60612002111504/W%C3%BCrth%20Elektronik/view-part?ref=eda>; AVAILABILITY: In Stock; DESCRIPTION: MCX Connector Jack, Female Socket 50Ohm Through Hole Solder; MF: Würth Elektronik; MP: 60612002111504; PACKAGE: None; PRICE: None; PURCHASE-URL: https://pricing.snapeda.com/search/part/60612002111504/?ref=eda
L2 = rcl:L-EU: INDUCTOR, European symbol; SPICEPREFIX: L
MH5-MH8 = my_library:MTGP700H400
R1 R3 R7-R9 R13 R20 R22-R24 R30 R32-R45 R49-R54 R58-R60 R64-R66 R70-R75 R79-R81 = resistor:R-US_: RESISTOR, American symbol
R4-R6 R10 R12 R14-R19 R21 R25-R27 = rcl:R-US_: RESISTOR, American symbol; SPICEPREFIX: R
TP1-TP6 TP9-TP11 TP13-TP17 TP19 TP21-TP25 TP27 TP29 = my_library:TESTPOINT
U1 U2 U13 U25 U27 = my_library:ADS7841E_2K5; DATASHEET_URL: http://www.ti.com/lit/gpn/ADS7841; DESCRIPTION: 12-Bit, 4-Channel Serial Output Sampling Analog-to-Digital Converter; FAMILY_NAME: PRECISION ADC (<=10MSPS); GENERIC_PART_NUMBER: ADS7841; INDUSTRY_STD_PKG_TYPE: SSOP/QSOP; MANUFACTURER: Texas Instruments; PACKAGE_DESIGNATOR: DBQ; PIN_COUNT: 16
U3 U6 U8-U12 U14 U16 U17 U19 U21 U23 U26 U29 = my_library:TSV991AILT: TVS991 General Purpose Op-Amp
U4 U5 = my_library:LM20BIM7X_NOPB
U$1 = my_library:SSR_MOUNT_03
U$2 = 2088900001:2088900001

## Board
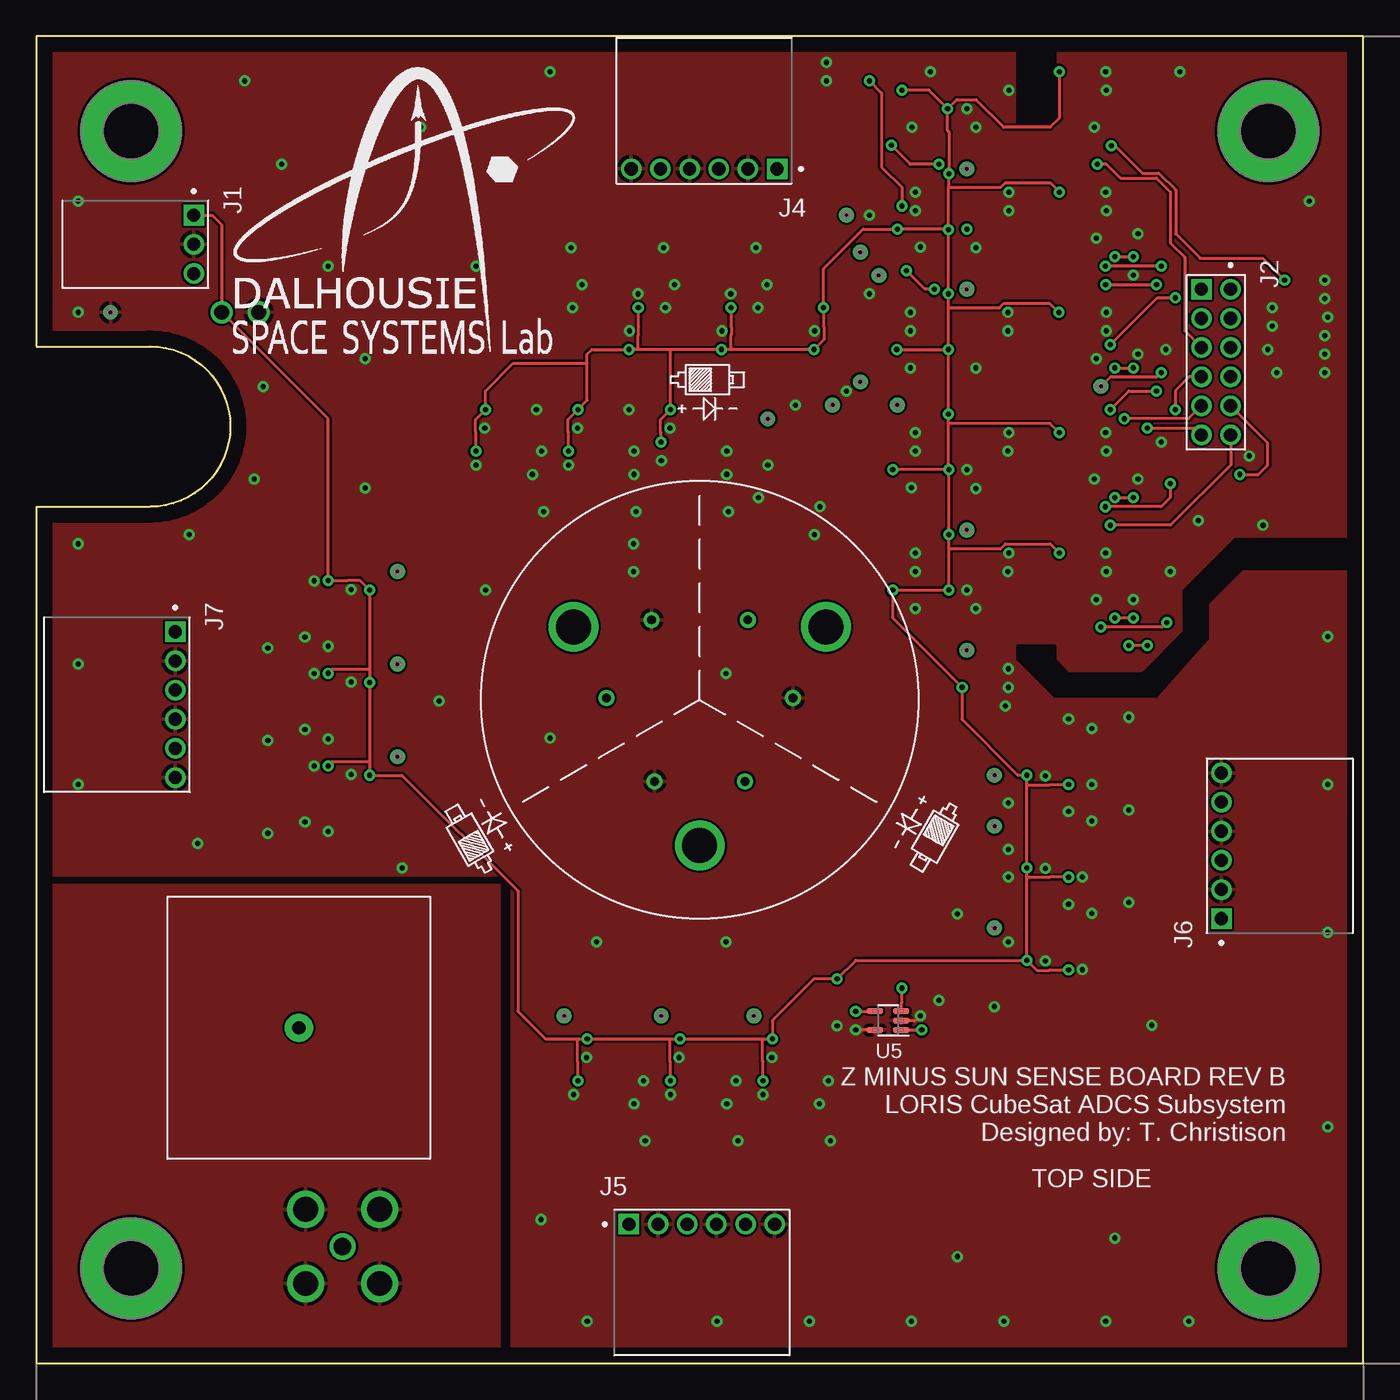
[diagram p6: board, top side]
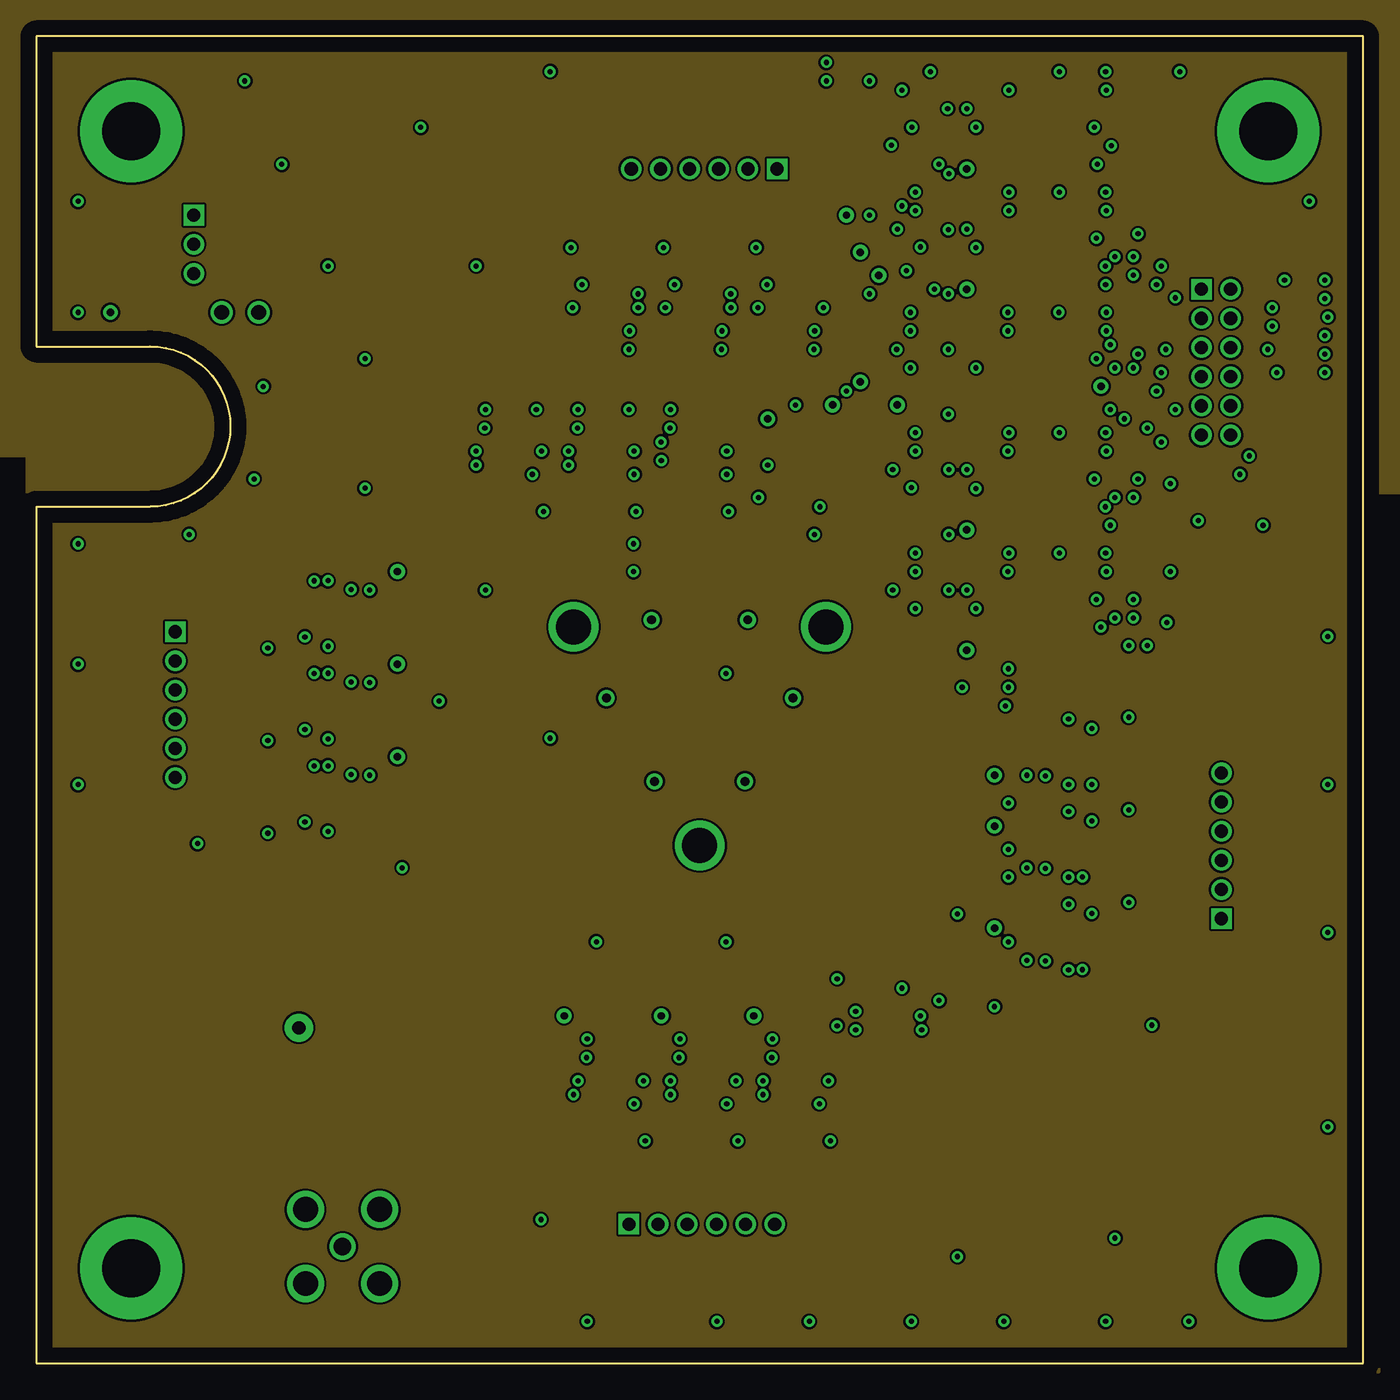
[diagram p7: board, inner layer Route2]
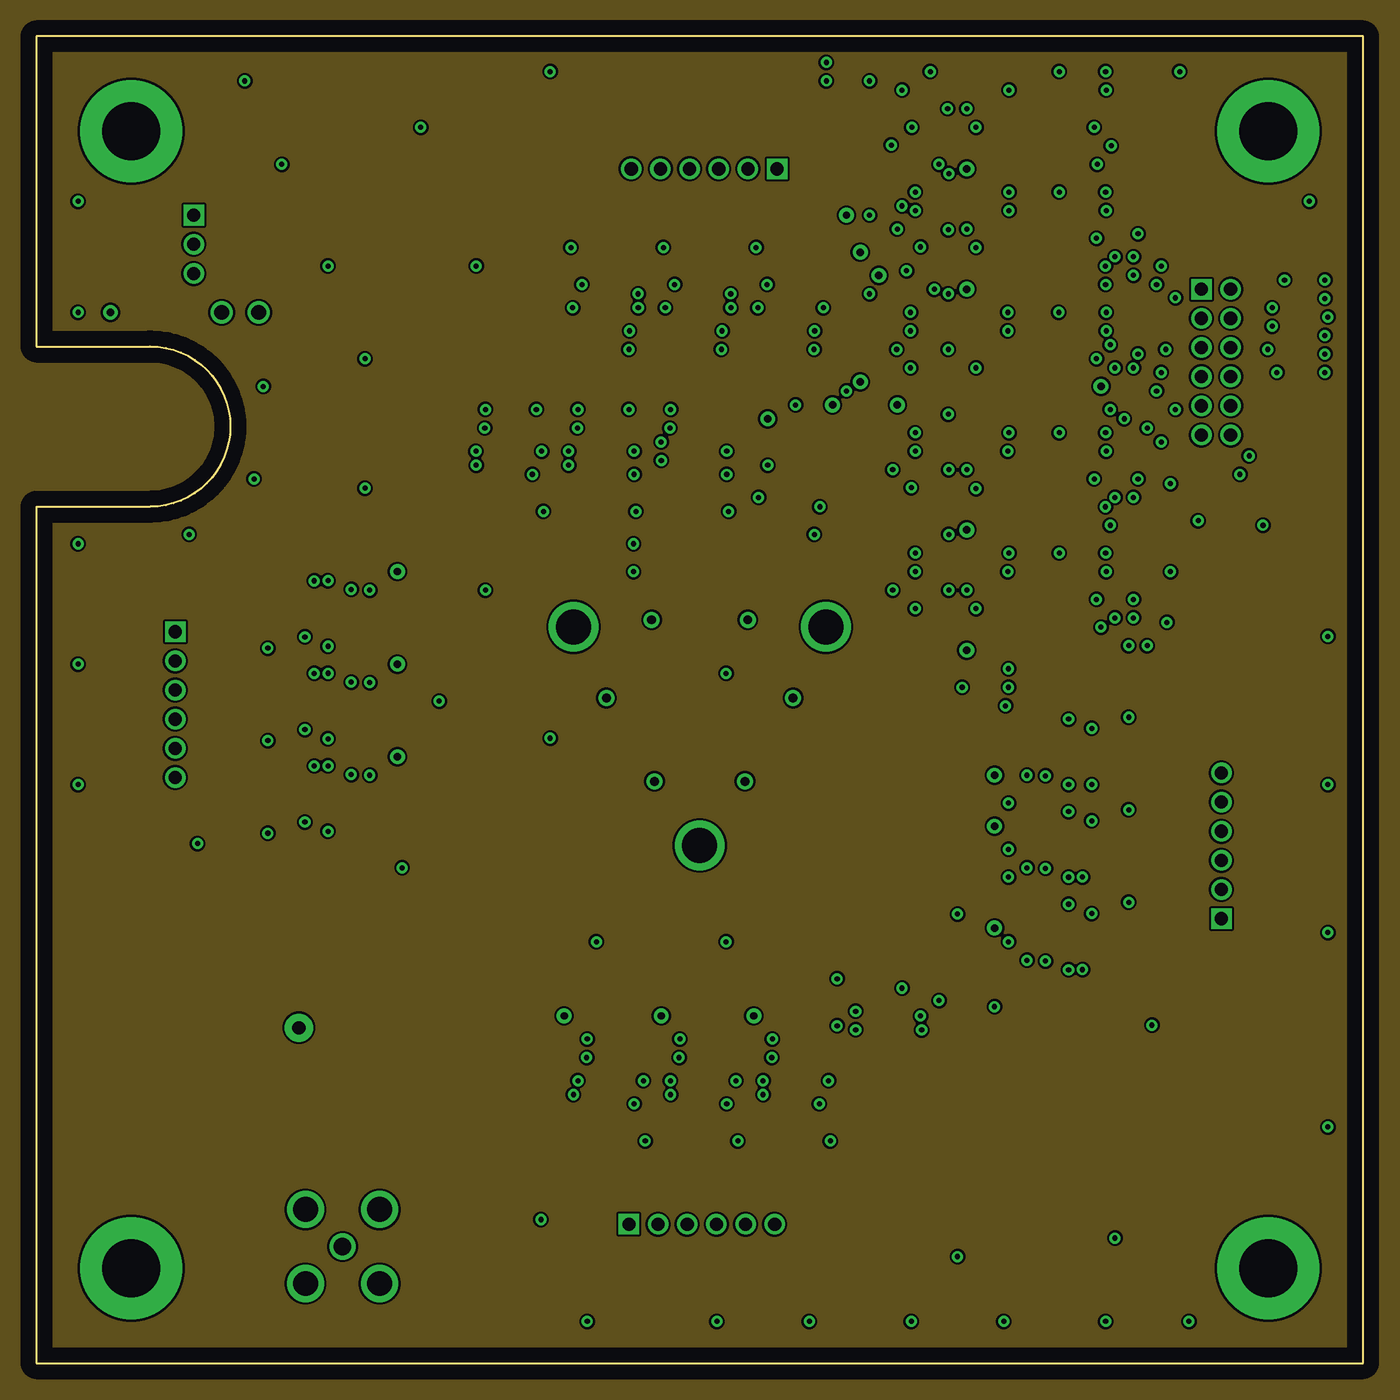
[diagram p8: board, inner layer Route15]
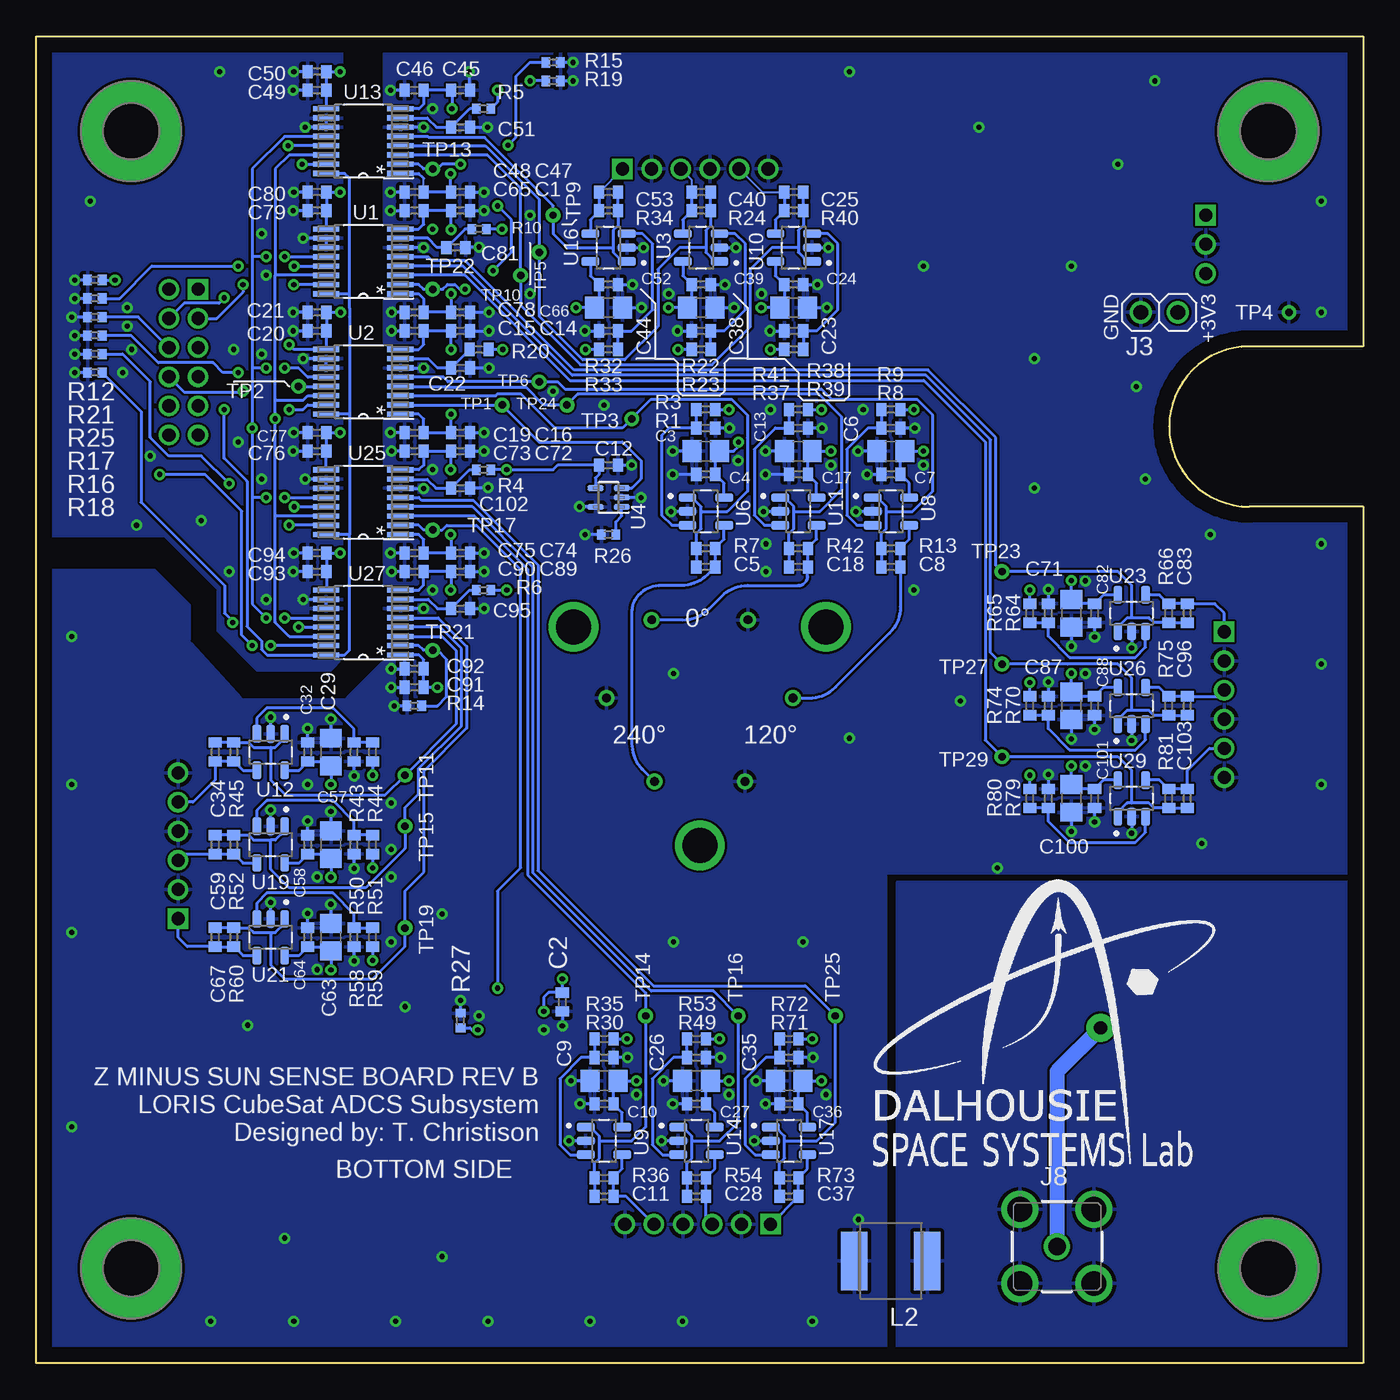
[diagram p9: board, bottom side, seen from below]

Size 91 x 91 mm. Coordinates in mm from the lower left corner, seen from the top.
Outline: 0,0 91,0 91,91 0,91 0,69.74 7.8,69.74 arc-180 7.8,58.74 0,58.74 0,0
Copper layers (1*16): Top 0.035mm / dielectric 1.5mm / Bottom 0.035mm
Design rules "default": minimum track width 6mil, minimum drill 0.35mm, track to track 6mil, track to pad 6mil, pad to pad 6mil, via to via 6mil, smd to smd 6mil, copper to edge 40mil, drill to drill 6mil, minimum pad ring 10mil, minimum via ring 8mil, stop-mask expansion 4mil, vias tented up to drill 0mil, thermal gap 10mil

### Footprints (pad centres in the part's own frame; a part is rotated, then mirrored left to right if it is on the bottom)
C0402 = smd 0.7 x 0.9: 1 -0.65,0; 2 0.65,0
C0805 = smd 1.3 x 1.5: 1 -0.95,0; 2 0.95,0
830-10-003-20-005000 = drill 0.9 pad 1.25 square: 1 0,0 | drill 0.9 pad 1.25: 2 2,0; 3 4,0
832-10-012-10-005000 = drill 0.9 pad 1.25 square: 1 0,-2 | drill 0.9 pad 1.25: 2 0,0; 3 2,-2; 4 2,0; 5 4,-2; 6 4,0; 7 6,-2; 8 6,0; 9 8,-2; 10 8,0; 11 10,-2; 12 10,0
1X02 = drill 1.016: 1 -1.27,0; 2 1.27,0
830-10-006-20-005000 = drill 0.9 pad 1.25 square: 1 0,0 | drill 0.9 pad 1.25: 2 2,0; 3 4,0; 4 6,0; 5 8,0; 6 10,0
60612002111504 = drill 1.2: 1 0,0 | drill 1.7: 2 -2.54,2.54; 3 2.54,2.54; 4 2.54,-2.54; 5 -2.54,-2.54
L5650M = smd 1.8 x 4: 1 -2.5,0; 2 2.5,0
MTGP700H400 = drill 4 pad 7: 1 0,0
R0402 = smd 0.7 x 0.9: 1 -0.65,0; 2 0.65,0
R0402' = smd 0.6 x 0.7: 1 -0.5,0; 2 0.5,0
TP_P76H50 = drill 0.51 pad 0.762: 1 0,0
DBQ16 = smd 1.803 x 0.356: 1 -2.553,2.223; 2 -2.553,1.587; 3 -2.553,0.953; 4 -2.553,0.318; 5 -2.553,-0.318; 6 -2.553,-0.953; 7 -2.553,-1.587; 8 -2.553,-2.223; 9 2.553,-2.223; 10 2.553,-1.587; 11 2.553,-0.953; 12 2.553,-0.318; 13 2.553,0.318; 14 2.553,0.953; 15 2.553,1.587; 16 2.553,2.223
SOT95P280X145-5N = smd 1.21 x 0.59: 1 -1.255,0.95; 2 -1.255,0; 3 -1.255,-0.95; 4 1.255,-0.95; 5 1.255,0.95
SOT23-5P65_210X110L40X22N_LM20 = smd 0.38 x 1.11: 1 -0.65,-0.9; 2 0,-0.9; 3 0.65,-0.9; 4 0.65,0.9; 5 -0.65,0.9
SSR_MOUNT_03 = drill 2.4: 1 -8.66,5; 2 8.66,5; 3 0,-10 | drill 0.6: A1 -3.3,5.48; A2 -3.1,-5.6; A3 6.4,0.12; C1 3.3,5.48; C2 -6.4,0.12; C3 3.1,-5.6
2088900001 = drill 0.9 pad 1.93: P$1 9,9

### Placement (x,y rotation side)
C1  61.91,79.06 0 bottom
C2  54.93,24.77 270 bottom
C3  45.09,62.55 180 bottom
C4  45.09,60.96 180 bottom
C5  45.09,54.61 180 bottom
C6  32.38,62.55 180 bottom
C7  32.38,60.96 180 bottom
C8  32.38,54.61 180 bottom
C9  52.07,19.37 180 bottom
C10  52.07,17.78 180 bottom
C11  52.07,11.43 180 bottom
C12  51.75,61.59 0 bottom
C13  38.73,62.55 180 bottom
C14  61.91,70.8 0 bottom
C15  65.09,70.8 180 bottom
C16  61.91,63.82 0 bottom
C17  38.73,60.96 180 bottom
C18  38.73,54.61 180 bottom
C19  65.09,63.82 180 bottom
C20  71.75,70.8 180 bottom
C21  71.75,72.07 180 bottom
C22  61.91,68.26 0 bottom
C23  39.05,72.39 0 bottom
C24  39.05,73.98 0 bottom
C25  39.05,80.33 0 bottom
C26  45.72,19.37 180 bottom
C27  45.72,17.78 180 bottom
C28  45.72,11.43 180 bottom
C29  70.8,41.91 90 bottom
C32  72.39,41.91 90 bottom
C34  78.74,41.91 90 bottom
C35  39.37,19.37 180 bottom
C36  39.37,17.78 180 bottom
C37  39.37,11.43 180 bottom
C38  45.4,72.39 0 bottom
C39  45.4,73.98 0 bottom
C40  45.4,80.33 0 bottom
C44  51.75,72.39 0 bottom
C45  61.91,87.31 0 bottom
C46  65.09,87.31 180 bottom
C47  61.91,80.33 0 bottom
C48  65.09,80.33 180 bottom
C49  71.75,87.31 180 bottom
C50  71.75,88.58 180 bottom
C51  61.91,84.77 0 bottom
C52  51.75,73.98 0 bottom
C53  51.75,80.33 0 bottom
C57  70.8,35.56 90 bottom
C58  72.39,35.56 90 bottom
C59  78.74,35.56 90 bottom
C63  70.8,29.21 90 bottom
C64  72.39,29.21 90 bottom
C65  65.09,79.06 180 bottom
C66  61.91,72.07 0 bottom
C67  78.74,29.21 90 bottom
C71  20,51.44 270 bottom
C72  61.91,62.55 0 bottom
C73  65.09,62.55 180 bottom
C74  61.91,55.56 0 bottom
C75  65.09,55.56 180 bottom
C76  71.75,62.55 180 bottom
C77  71.75,63.82 180 bottom
C78  65.09,72.07 180 bottom
C79  71.75,79.06 180 bottom
C80  71.75,80.33 180 bottom
C81  62.23,76.52 0 bottom
C82  18.41,51.44 270 bottom
C83  12.06,51.44 270 bottom
C87  20,45.09 270 bottom
C88  18.41,45.09 270 bottom
C89  61.91,54.29 0 bottom
C90  65.09,54.29 180 bottom
C91  65.09,46.35 180 bottom
C92  65.09,47.62 180 bottom
C93  71.75,54.29 180 bottom
C94  71.75,55.56 180 bottom
C95  61.91,51.75 0 bottom
C96  12.06,45.09 270 bottom
C100  20,38.73 270 bottom
C101  18.41,38.73 270 bottom
C102  61.91,60.01 0 bottom
C103  12.06,38.73 270 bottom
J1  10.79,78.74 270 top
J2  81.92,73.66 270 top
J3  13.97,72.07 180 bottom
J4  50.8,81.92 180 top
J5  40.64,9.53 0 top
J6  81.28,30.48 90 top
J7  9.53,50.16 270 top
J8  21,8 0 bottom
L2  32.4,7 180 bottom
MH5  6.5,6.5 0 top
MH6  84.5,6.5 0 top
MH7  84.5,84.5 0 top
MH8  6.5,84.5 0 top
R1  45.09,64.14 180 bottom
R3  45.09,65.41 0 bottom
R4  10k  [R0402']  60.33,61.28 0 bottom
R5  10k  [R0402']  60.33,86.04 0 bottom
R6  10k  [R0402']  60.33,53.02 0 bottom
R7  45.09,55.88 180 bottom
R8  32.38,64.14 180 bottom
R9  32.38,65.41 0 bottom
R10  10k  [R0402']  60.64,77.79 0 bottom
R12  5.1M  [R0402']  87,74.3 0 bottom
R13  32.38,55.88 180 bottom
R14  5.1M  [R0402']  65.09,45.09 0 bottom
R15  5.1M  [R0402']  55.56,89.22 180 bottom
R16  5.1M  [R0402']  87,69.22 0 bottom
R17  5.1M  [R0402']  87,70.48 0 bottom
R18  5.1M  [R0402']  87,67.94 0 bottom
R19  5.1M  [R0402']  55.56,87.95 180 bottom
R20  60.64,69.53 0 bottom
R21  5.1M  [R0402']  87,73.03 0 bottom
R22  45.4,70.8 0 bottom
R23  45.4,69.53 180 bottom
R24  45.4,79.06 0 bottom
R25  5.1M  [R0402']  87,71.75 180 bottom
R26  5.1M  [R0402']  51.75,56.83 180 bottom
R27  5.1M  [R0402']  61.91,23.5 90 bottom
R30  52.07,20.95 180 bottom
R32  51.75,70.8 0 bottom
R33  51.75,69.53 180 bottom
R34  51.75,79.06 0 bottom
R35  52.07,22.23 0 bottom
R36  52.07,12.7 180 bottom
R37  38.73,64.14 180 bottom
R38  39.05,70.8 0 bottom
R39  39.05,69.53 180 bottom
R40  39.05,79.06 0 bottom
R41  38.73,65.41 0 bottom
R42  38.73,55.88 180 bottom
R43  69.22,41.91 90 bottom
R44  67.94,41.91 270 bottom
R45  77.47,41.91 90 bottom
R49  45.72,20.95 180 bottom
R50  69.22,35.56 90 bottom
R51  67.94,35.56 270 bottom
R52  77.47,35.56 90 bottom
R53  45.72,22.23 0 bottom
R54  45.72,12.7 180 bottom
R58  69.22,29.21 90 bottom
R59  67.94,29.21 270 bottom
R60  77.47,29.21 90 bottom
R64  21.59,51.44 270 bottom
R65  22.86,51.44 90 bottom
R66  13.34,51.44 270 bottom
R70  21.59,45.09 270 bottom
R71  39.37,20.95 180 bottom
R72  39.37,22.23 0 bottom
R73  39.37,12.7 180 bottom
R74  22.86,45.09 90 bottom
R75  13.34,45.09 270 bottom
R79  21.59,38.73 270 bottom
R80  22.86,38.73 90 bottom
R81  13.34,38.73 270 bottom
TP1  59.05,65.72 270 bottom
TP2  73.03,66.99 0 bottom
TP3  50.16,64.77 270 bottom
TP4  5.08,72.07 270 bottom
TP5  56.52,76.2 90 bottom
TP6  56.52,67.31 270 bottom
TP9  55.56,78.74 90 bottom
TP10  57.78,74.61 90 bottom
TP11  65.72,40.32 180 bottom
TP13  63.82,81.92 0 bottom
TP14  49.21,23.81 270 bottom
TP15  65.72,36.83 180 bottom
TP16  42.86,23.81 270 bottom
TP17  63.82,57.15 0 bottom
TP19  65.72,29.84 180 bottom
TP21  63.82,48.9 0 bottom
TP22  63.82,73.66 0 bottom
TP23  24.77,54.29 0 bottom
TP24  54.61,65.72 270 bottom
TP25  36.2,23.81 270 bottom
TP27  24.77,47.94 0 bottom
TP29  24.77,41.59 0 bottom
U1  68.58,75.56 180 bottom
U2  68.58,67.31 180 bottom
U3  45.4,76.52 180 bottom
U4  51.75,59.37 90 bottom
U5  58.42,23.5 90 top
U6  45.09,58.42 0 bottom
U8  32.38,58.42 0 bottom
U9  52.07,15.24 0 bottom
U10  39.05,76.52 180 bottom
U11  38.73,58.42 0 bottom
U12  74.93,41.91 270 bottom
U13  68.58,83.82 180 bottom
U14  45.72,15.24 0 bottom
U16  51.75,76.52 180 bottom
U17  39.37,15.24 0 bottom
U19  74.93,35.56 270 bottom
U21  74.93,29.21 270 bottom
U23  15.88,51.44 90 bottom
U25  68.58,59.05 180 bottom
U26  15.88,45.09 90 bottom
U27  68.58,50.8 180 bottom
U29  15.88,38.73 90 bottom
U$1  45.5,45.5 0 top
U$2  9,14 0 top
U$3  [PHOTODIODE_SILK]  46.04,66.67 180 top
U$4  [PHOTODIODE_SILK]  30.42,36.31 300 top
U$5  [PHOTODIODE_SILK]  60.97,36.49 60 top

### Tracks (layer width: path | path; a pad name or v marks a point on that pad's centre or on a via)
0_DEGREES
  Bottom 0.203: U11.1 39.69,59.37 39.05,58.73 39.05,58.42 | 39.05,58.42 39.05,57.23 39.38,56.9 R42.2 C18.2 | 39.05,58.42 37.26,58.42 35.76,59.91 35.76,64.92 37.31,66.47 53.87,66.47 TP24.1 56.2,65.72 57.43,66.95 62.92,66.95 62.95,66.99 U2.4
120_DEGREES
  Bottom 0.203: U2.5 63.09,67.63 62.77,67.31 TP6.1 55.24,67.31 54.76,66.82 37.17,66.82 36.45,66.11 30.61,66.11 29.52,65.02 29.52,59.8 30.91,58.42 32.7,58.42 | U8.1 33.34,59.37 32.7,58.73 32.7,58.42 | 32.7,58.42 32.7,57.23 33.03,56.9 R13.2 C8.2
240_DEGREES
  Bottom 0.203: U6.1 46.04,59.37 45.4,58.73 45.4,58.42 | 45.4,58.42 45.4,57.23 45.73,56.9 R7.2 C5.2 | 45.4,58.42 43.61,58.42 42.22,59.8 42.22,63.44 42.23,63.45 42.23,65.03 43.31,66.11 48.83,66.11 TP3.1 50.8,64.14 55.43,64.14 57.78,66.49 59.37,66.49 59.5,66.36 U2.3
!CS!_SUN_X+  (via drill 0.35)
  Top 0.203: v73.66,57.47 77.79,57.47 81.92,61.59 J2.12
  Bottom 0.203: U25.15 v73.66,57.47
!CS!_SUN_X-  (via drill 0.35)
  Top 0.203: v72.76,82.23 73.4,82.23 74.35,81.28 76.83,81.28 77.79,80.33 77.79,76.83 78.76,75.86 78.76,70.81 J2.5
  Bottom 0.203: v72.76,82.23 U13.15
!CS!_SUN_Y+  (via drill 0.35)
  Top 0.203: v76.2,49.21 v74.93,49.21 | v82.55,60.96 83.82,60.96 84.45,61.59 84.45,63.12 J2.10
  Bottom 0.203: U27.15 v74.93,49.21 | v76.2,49.21 76.91,49.92 76.91,58.44 79.43,60.96 v82.55,60.96
!CS!_SUN_Y-  (via drill 0.35)
  Top 0.203: v73.34,73.98 v76.83,73.98
  Bottom 0.203: U1.15 v73.34,73.98 | v76.83,73.98 76.83,73.47 78.64,71.66 J2.3
!CS!_SUN_Z-  (via drill 0.35)
  Top 0.203: v73.66,65.41 74.93,66.67 v76.83,66.67
  Bottom 0.203: v73.66,65.41 72.71,65.41 72.39,65.72 U2.15 | J2.8 80.87,66.62 76.89,66.62 v76.83,66.67
+3V2
  pour Route15 (rank 6, no thermals): -4.45,93.98 -4.45,-3.81 95.25,-3.81 95.25,92.71 95.25,93.98
+3V3  (via drill 0.35)
  Top 0.203: U5.4 57.51,24.13 v56.2,24.13 | 22.86,47.62 v22.86,53.02 22.18,53.7 21.33,53.7 21.3,53.67 v20,53.67 20,64.77 J3.1 12.7,78.11 12.06,78.74 J1.1 | 22.86,47.62 v22.86,46.67 22.86,41.27 | v20,47.32 20.31,47.62 22.86,47.62 | 22.86,41.27 v22.86,40.32 25.08,40.32 33.02,32.38 33.02,24.13 34.92,22.23 37.15,22.23 | v20,40.97 20.31,41.27 22.86,41.27 | 37.15,22.23 v37.78,22.23 43.5,22.23 | v37.14,19.37 37.14,20.66 37.11,20.69 37.11,22.18 37.15,22.23 | 43.5,22.23 v44.13,22.23 49.85,22.23 | v43.49,19.37 43.49,20.66 43.46,20.69 43.46,22.18 43.5,22.23 | 49.85,22.23 v50.48,22.23 50.48,23.5 53.34,26.35 v54.93,26.35 56.2,27.62 v67.94,27.62 | v49.84,19.37 49.84,20.66 49.81,20.69 49.81,22.18 49.85,22.23 | v70.8,26.98 69.51,26.98 69.48,26.95 68.62,26.95 v67.94,27.62 | v67.94,27.62 67.94,33.34 | 67.94,33.34 v67.94,33.97 67.94,39.69 | v70.8,33.33 69.51,33.33 69.48,33.3 67.98,33.3 67.94,33.34 | 67.94,39.69 v67.94,40.32 67.31,40.32 63.5,44.13 v63.5,46.35 58.74,51.12 v58.74,53.02 v62.59,53.02 62.59,55.88 | v70.8,39.68 69.51,39.68 69.48,39.65 67.98,39.65 67.94,39.69 | 62.59,55.88 v62.59,56.83 v62.59,61.28 | 62.59,55.88 66.14,55.88 66.46,56.2 69.53,56.2 v70.17,55.56 | v62.59,61.28 v58.74,61.28 | v62.59,61.28 62.55,61.32 62.55,64.45 | 62.55,64.45 v62.55,65.09 v62.55,69.53 | v70.17,63.82 69.53,64.45 62.55,64.45 | 62.55,72.39 v62.55,73.34 v62.55,77.74 | v59.01,69.53 v62.55,69.53 | 62.55,72.39 66.06,72.39 66.37,72.7 69.49,72.7 v70.12,72.07 | v62.55,77.74 62.5,77.79 v59.05,77.79 56.71,77.79 53.98,75.06 v53.98,72.39 53.98,71.1 54.02,71.06 54.02,70.21 v53.34,69.53 47.62,69.53 | v62.55,77.74 62.55,80.64
  Top 0.203: 62.55,80.64 62.55,81.55 v62.59,81.6 62.59,84.45 62.5,84.54 v62.5,86.04 | 62.55,80.64 66.14,80.64 66.46,80.96 69.53,80.96 v70.17,80.33 | v62.5,86.04 61.23,87.31 v59.37,87.31 | v70.17,88.58 70.17,85.41 69.53,84.77 66.36,84.77 64.45,86.67 63.14,86.67 v62.5,86.04 | 47.62,69.53 v46.99,69.53 43.5,69.53 | 47.62,69.53 47.62,70.5 47.66,70.54 47.66,71.06 47.63,71.1 v47.63,72.39 | 43.5,69.53 41.27,69.53 | 41.27,69.53 v40.64,69.53 38.1,69.53 37.78,69.22 37.78,68.58 | 41.27,69.53 41.27,70.5 41.31,70.54 41.31,71.06 41.28,71.1 v41.28,72.39 | v42.85,63.18 42.85,63.84 42.82,63.87 42.82,64.73 v43.5,65.41 43.5,69.53 | v36.5,62.55 36.5,63.84 36.47,63.87 36.47,64.73 v37.15,65.41 37.78,66.04 37.78,68.58 | v30.15,62.55 30.15,63.84 30.12,63.87 30.12,64.73 v30.8,65.41 30.8,66.67 32.7,68.58 37.78,68.58 | v78.13,73.07 76.88,73.07 v73.66,69.85 | v62.55,69.53 62.55,72.39
  Bottom 0.152: C48.1 64.44,81.27
  Bottom 0.203: v70.17,63.82 C77.1 C76.1 71.13,62.52 U25.9 | v62.59,56.83 62.56,56.8 C74.1 C75.1 64.44,56.5 64.77,56.83 U25.1 | v62.59,53.02 62.56,53.05 C89.1 62.58,54.31 64.38,54.31 C90.1 64.47,54.26 64.47,53.34 64.78,53.02 U27.8 | R6.2 v58.74,53.02 | U25.8 64.77,61.28 64.45,61.59 64.44,61.59 C73.1 C72.1 62.56,61.31 v62.59,61.28 | v59.37,87.31 59.37,86.5 R5.2 | v62.55,73.34 62.56,73.33 C66.1 C78.1 64.44,73.01 64.77,73.34 U1.1 | v62.5,86.04 62.5,87.25 C45.1 C46.1 64.44,86.36 64.75,86.04 U13.8 | U27.9 71.11,53.05 C93.1 C94.1 v70.17,55.56 | U13.1 64.77,81.6 64.44,81.27 | C48.1 C47.1 62.59,80.36 v62.59,81.6 | R4.2 v58.74,61.28 55.56,61.28 55.24,61.59 C12.1 52.4,60.96 52.65,60.71 U4.4 | U1.8 64.77,77.79 64.44,78.12 C65.1 C1.1 62.55,79.07 v62.55,77.74 | v59.05,77.79 R10.2 | U27.1 64.75,48.58 64.44,48.26 C92.1 C91.1 v63.5,46.35 | v70.17,88.58 C50.1 C49.1 71.11,86.04 71.13,86.02 U13.9 | U1.9 71.13,79.03 C79.1 C80.1 v70.17,80.33 | U2.1 64.77,65.09 64.44,64.75 C19.1 62.83,63.82 62.77,63.87 C16.1 62.55,63.83 v62.55,65.09 | U2.8 64.77,69.53 64.44,69.86 64.44,70.48 | 64.44,70.48 C15.1 | v70.12,72.07 C21.1 C20.1 71.13,70.78 U2.9 73.34,69.53 v73.66,69.85 | v59.01,69.53 R20.2 | U6.5 43.83,60.35 C4.1 44.44,62.24 C3.1 | C3.1 | C3.1 43.17,62.55 42.85,62.87 v42.85,63.18 | R3.2 v43.5,65.41 | U8.5 31.13,60.35 C7.1 31.73,62.24 C6.1 | C6.1 | C6.1 v30.15,62.55 | R9.2 v30.8,65.41 | U11.5 37.48,60.35 C17.1 38.09,62.24 C13.1 | C13.1 | C13.1 v36.5,62.55 | R41.2 v37.15,65.41 | U9.5 50.81,17.18 C10.1 51.42,19.07 C9.1 | C9.1 | C9.1 v49.84,19.37 | R35.2 v50.48,22.23 | U14.5 44.47,17.18 C27.1 45.07,19.07 C26.1 | C26.1 | C26.1 v43.49,19.37 | R53.2 v44.13,22.23
  Bottom 0.203: U17.5 38.12,17.18 C36.1 38.72,19.07 C35.1 | C35.1 | C35.1 v37.14,19.37 | R72.2 v37.78,22.23 | U10.5 40.31,74.58 C24.1 39.7,72.69 C23.1 | C23.1 | C23.1 v41.28,72.39 | R39.2 v40.64,69.53 | U12.5 73,40.66 C32.1 71.11,41.26 C29.1 | C29.1 | C29.1 v70.8,39.68 | R44.2 v67.94,40.32 | U3.5 46.66,74.58 C39.1 46.05,72.69 C38.1 | C38.1 | C38.1 v47.63,72.39 | R23.2 v46.99,69.53 | U16.5 53.01,74.58 C52.1 52.4,72.69 C44.1 | C44.1 | C44.1 v53.98,72.39 | R33.2 v53.34,69.53 | U19.5 73,34.3 C58.1 71.11,34.91 C57.1 | C57.1 | C57.1 v70.8,33.33 | R51.2 v67.94,33.97 | U21.5 73,27.95 C64.1 71.11,28.56 C63.1 | C63.1 | C63.1 v70.8,26.98 | R59.2 v67.94,27.62 | U23.5 17.81,52.69 C82.1 19.7,52.09 C71.1 | C71.1 | C71.1 v20,53.67 | R65.2 v22.86,53.02 | U26.5 17.81,46.34 C88.1 19.7,45.73 C87.1 | C87.1 | C87.1 v20,47.32 | R74.2 v22.86,46.67 | U29.5 17.81,39.99 C101.1 19.7,39.38 C100.1 | C100.1 | C100.1 v20,40.97 | R80.2 v22.86,40.32 | v54.93,26.35 C2.1 55.87,25.41 56.2,25.08 v56.2,24.13 | J2.4 80.87,72.7 78.47,72.7 78.13,73.04 v78.13,73.07 | v62.55,69.53 62.55,70.79 C14.1 64.12,70.8 64.44,70.48
+3V4
  pour Route15 (rank 6, no thermals): 144.78,114.94 144.78,17.14 244.47,17.14 244.47,113.67 244.47,114.94
+3V5
  pour Route15 (rank 6, no thermals): 35.56,154.31 35.56,56.52 135.25,56.52 135.25,153.03 135.25,154.31
+3V6
  pour Route15 (rank 6, no thermals): 98.42,211.46 98.42,113.67 198.12,113.67 198.12,210.19 198.12,211.46
+3V7
  pour Route15 (rank 6, no thermals): -12.06,156.84 -12.06,59.05 87.63,59.05 87.63,155.57 87.63,156.84
+3V8
  pour Route15 (rank 6, no thermals): 10.79,227.33 10.79,129.54 110.49,129.54 110.49,226.06 110.49,227.33
+3V9
  pour Route15 (rank 6, no thermals): 88.9,210.82 88.9,113.03 188.59,113.03 188.59,209.55 188.59,210.82
+3V10
  pour Route15 (rank 6, no thermals): 168.28,227.97 168.28,130.18 267.97,130.18 267.97,226.69 267.97,227.97
+3V11
  pour Route15 (rank 6, no thermals): 108.58,210.82 108.58,113.03 208.28,113.03 208.28,209.55 208.28,210.82
+3V12
  pour Route15 (rank 6, no thermals): 23.5,226.06 23.5,128.27 123.19,128.27 123.19,224.79 123.19,226.06
+3V14
  pour Route15 (rank 6, no thermals): 36.83,227.33 36.83,129.54 136.53,129.54 136.53,226.06 136.53,227.33
+3V16
  pour Route15 (rank 6, no thermals): 179.71,226.69 179.71,128.91 279.4,128.91 279.4,225.43 279.4,226.69
+3V18
  pour Route15 (rank 6, no thermals): 191.77,226.69 191.77,128.91 291.46,128.91 291.46,225.43 291.46,226.69
+3V20
  pour Route15 (rank 6, no thermals): 125.09,121.28 125.09,23.5 224.79,23.5 224.79,120.02 224.79,121.28
+3V22
  pour Route15 (rank 6, no thermals): 137.79,126.36 137.79,28.57 237.49,28.57 237.49,125.09 237.49,126.36
+3V24
  pour Route15 (rank 6, no thermals): 104.78,80.64 104.78,-17.14 204.47,-17.14 204.47,79.38 204.47,80.64
GND  (via drill 0.35)
  Top 0.203: U5.5 56.21,22.84 v56.2,22.86 | U5.2 60.33,23.5 v60.64,23.81
  Bottom 0.203: R26.2 v53.37,56.83 | v49.54,59.37 U4.2 | U4.5 52.67,58.74 v53.74,58.74 | C12.2 v50.16,61.59 | C15.2 v66.63,70.8 | C16.2 v60.28,63.82 | C19.2 v66.72,63.82 | C20.2 v73.39,70.8 | v59.96,68.26 C22.2 | C14.2 v59.96,70.8 | v66.72,79.06 C65.2 | C66.2 v59.96,72.07 | C78.2 v66.63,72.07 | C79.2 v73.39,79.06 | C80.2 v73.34,80.33 | U13.10 U13.11 v72.56,84.77 | C46.2 v66.72,87.31 | C47.2 v60.28,80.33 | C48.2 v66.72,80.33 | C51.2 v60.05,84.77 | C49.2 v73.39,87.31 | C50.2 v73.34,88.58 | C73.2 v66.63,62.55 | C72.2 v60.28,62.55 | C74.2 v60.28,55.56 | C75.2 v66.72,55.56 | v73.39,62.55 C76.2 | C77.2 v73.34,63.82 | C90.2 v66.63,54.29 | C89.2 v60.28,54.29 | C95.2 v60.28,51.75 | C93.2 v73.39,54.29 | C94.2 v73.34,55.56 | U25.6 66,59.98 v64.45,59.98 | v60.01,60.05 61.22,60.05 C102.2 | v64.45,76.52 U1.6 | v72.56,60.64 U25.10 U25.11 | v66.67,47.62 C92.2 | v66.67,46.35 C91.2 | U1.11 U1.10 v72.71,77.15 | v61.32,88.58 61.32,87.37 C45.2 | v64.45,84.77 U13.6 | v64.45,51.75 U27.6 | C81.2 61.54,76.56 v60.64,76.56 | v72.71,52.39 U27.10 U27.11 | C1.2 v60.28,79.06 | C21.2 v73.39,72.07 | U2.6 v64.45,68.26 | C4.2 v47.35,60.96 | v43.45,64.14 R1.1 | U6.2 v47.48,58.42 | C6.2 v34.65,62.55 | C7.2 v34.02,60.96 | v30.75,64.14 R8.1 | U8.2 v34.78,58.42 | C13.2 v41,62.55 | C17.2 v41,60.96 | v37.1,64.14 R37.1 | U11.2 v41.13,58.42 | C9.2 v54.34,19.37 | C10.2 v53.7,17.78 | v50.44,20.95 R30.1 | U9.2 v54.46,15.24 | C26.2 v47.99,19.37 | C27.2 v47.35,17.78 | v44.09,20.95 R49.1 | U14.2 v48.11,15.24 | C35.2 v41.64,19.37 | C36.2 v41,17.78 | v37.74,20.95 R71.1 | U17.2 v41.76,15.24 | C23.2 v36.79,72.39 | C24.2 v37.42,73.98 | v40.68,70.8 R38.1 | U10.2 v36.66,76.52 | C29.2 v70.8,44.18 | C32.2 v72.39,43.54 | v69.22,40.28 R43.1 | U12.2 v74.93,44.3 | C38.2 v43.14,72.39 | C39.2 v43.77,73.98
  Bottom 0.203: v47.03,70.8 R22.1 | U3.2 v43.01,76.52 | C44.2 v49.49,72.39 | C52.2 v50.12,73.98 | v53.38,70.8 R32.1 | U16.2 v49.36,76.52 | C57.2 v70.8,37.83 | C58.2 v72.39,37.19 | v69.22,33.93 R50.1 | U19.2 v74.93,37.95 | C63.2 v70.8,31.48 | C64.2 v72.39,30.84 | v69.22,27.58 R58.1 | U21.2 v74.93,31.6 | C71.2 v20,49.17 | C82.2 v18.41,49.8 | v21.59,53.07 R64.1 | U23.2 v15.88,49.04 | C87.2 v20,42.82 | C88.2 v18.41,43.45 | v21.59,46.72 R70.1 | U26.2 v15.88,42.69 | C100.2 v20,36.47 | C101.2 v18.41,37.1 | v21.59,40.37 R79.1 | U29.2 v15.88,36.34 | U2.11 U2.10 v72.71,68.9 | R25.2 v88.58,71.75 | R14.1 v66.47,45.09 | R12.1 v88.38,74.3 | R21.1 v88.38,73.03 | R17.1 v88.38,70.48 | v88.38,69.22 R16.1 | R18.1 v88.38,67.94 | R27.2 v61.91,24.88 | C2.2 v54.93,23.13 | R15.1 v54.18,89.22 | R19.1 v54.18,87.95 | C3.2 v47.35,62.55
  other vias: 63.82,61.28 63.82,53.02 63.82,86.04 75.56,60.64 75.56,77.47 75.25,74.61 75.56,69.22 75.25,52.39 79.69,57.78 77.79,54.29 77.15,63.18 77.47,69.53 84.77,72.39 84.77,71.12 84.45,69.53 85.09,67.94 83.19,62.23 66.67,28.89 66.67,33.34 66.67,35.24 66.67,38.42 36.83,18.41 43.5,18.41 49.85,18.41 57.15,73.34 40.64,65.41 34.29,65.41 40.96,56.2 40.96,54.29 52.07,65.72 55.56,66.67 41.27,73.34 47.62,73.34 57.15,78.74 72.39,39.69 71.75,33.34 71.75,26.99 19.05,53.66 19.05,47.31 19.05,40.96 30.16,61.59 36.51,61.59 42.86,61.91 30.8,53.02 22.54,68.9 30.16,75.25 16.83,82.23 2.86,79.69 14.29,87.95 26.35,84.77 35.24,88.58 78.42,88.58 87.31,79.69 84.14,57.47 88.58,49.85 88.58,39.69 88.58,29.53 88.58,16.19 79.06,2.86 73.34,2.86 66.36,2.86 60.01,2.86 53.02,2.86 46.67,2.86 37.78,2.86 2.86,39.69 2.86,47.94 2.86,56.2 10.48,56.83 14.92,60.64 15.56,66.99 2.86,72.07 20,75.25 22.54,60.01 27.62,45.4 25.08,33.97 11.05,35.64 34.61,9.84 35.24,42.86 38.42,28.89 47.31,28.89 63.18,30.8 65.72,24.45 76.52,23.18 63.18,7.3 73.98,8.57 47.31,47.31
  pour Bottom: 32.78,94.3 -2.9,94.3 -2.56,33.6 32.78,33.6 32.78,-2.22 93.03,-2.22 93.03,94.3
  pour Top: 32.59,95.25 95.25,95.25 95.25,-1.91 32.59,-1.91 32.6,33.4 -4,33.4 -4,95
  cutout Top: 67.31,48.26 67.31,49.21 69.85,49.21 69.85,48.26 70.8,47.31 75.88,47.31 78.74,50.16 78.74,53.02 82.23,56.52 91.12,56.52 91.12,54.45 82.71,54.45 80.33,52.07 80.33,49.65 76.83,45.72 69.85,45.72
  cutout Top: 67.31,85.09 67.31,90.81 69.85,90.81 69.85,85.09
  cutout Bottom: 67.31,90.81 69.85,90.81 69.85,48.26 70.8,47.31 75.88,47.31 78.74,50.16 78.74,53.02 82.23,56.52 91.12,56.52 91.12,54.61 82.87,54.61 80.33,52.07 80.33,49.53 80.3,49.53 76.83,45.72 69.85,45.72 67.31,48.26
GND2
  pour Route2 (no thermals): -0.64,92.08 92.08,92.08 92.08,-0.64 -0.64,-0.64
GND3
  pour Route2 (no thermals): 148.59,113.03 241.3,113.03 241.3,20.32 148.59,20.32
GND4
  pour Route2 (no thermals): 39.37,152.4 132.08,152.4 132.08,59.69 39.37,59.69
GND5
  pour Route2 (no thermals): 102.23,209.55 194.94,209.55 194.94,116.84 102.23,116.84
GND6
  pour Route2 (no thermals): -8.26,154.94 84.45,154.94 84.45,62.23 -8.26,62.23
GND7
  pour Route2 (no thermals): 14.61,225.43 107.31,225.43 107.31,132.72 14.61,132.72
GND8
  pour Route2 (no thermals): 92.71,208.91 185.42,208.91 185.42,116.2 92.71,116.2
GND9
  pour Route2 (no thermals): 172.09,226.06 264.8,226.06 264.8,133.35 172.09,133.35
GND10
  pour Route2 (no thermals): 112.39,208.91 205.1,208.91 205.1,116.2 112.39,116.2
GND11
  pour Route2 (no thermals): 27.3,224.16 120.02,224.16 120.02,131.44 27.3,131.44
GND13
  pour Route2 (no thermals): 40.64,225.43 133.35,225.43 133.35,132.72 40.64,132.72
GND15
  pour Route2 (no thermals): 183.51,224.79 276.23,224.79 276.23,132.08 183.51,132.08
GND17
  pour Route2 (no thermals): 195.58,224.79 288.29,224.79 288.29,132.08 195.58,132.08
GND19
  pour Route2 (no thermals): 128.91,119.38 221.62,119.38 221.62,26.67 128.91,26.67
GND21
  pour Route2 (no thermals): 141.6,124.46 234.31,124.46 234.31,31.75 141.6,31.75
GND23
  pour Route2 (no thermals): 108.58,78.74 201.29,78.74 201.29,-13.97 108.58,-13.97
GND_A
  pour Bottom: -3,33 32,33 32,-2 -3,-2
  pour Top: 31.8,32.8 -3.8,32.8 -3.8,-2.5 31.8,-2.5
N$2  (via drill 0.35)
  Top 0.203: v77.15,67.94 76.83,67.63 73.66,67.63 TP2.1
  Bottom 0.203: TP2.1 U2.13 | v77.15,67.94 78.21,67.94 78.88,68.62 82.65,68.62 84.51,70.48 R17.2
N$3
  Bottom 0.203: U12.4 76.83,40.66 77.44,41.26 R45.1 C34.1 78.74,40.01 80.27,38.48 J6.5
N$4
  Bottom 0.203: U25.7 66,60.61 64.19,60.61 63.59,60.01 C102.1 61.29,61.28 R4.1
N$5
  Bottom 0.203: U19.4 76.83,34.3 77.44,34.91 R52.1 C59.1 80.85,34.91 J6.3
N$6
  Bottom 0.203: U10.3 36.72,77.47 36.03,76.78 36.03,72.25 37.48,70.8 R38.2 R39.1
N$7
  Bottom 0.203: U4.1 50.85,58.1 51.25,57.7 R26.1
N$8
  Bottom 0.203: R1.2 45.73,63.83 | U6.3 47.42,57.47 48.11,58.16 48.11,63.64 47.61,64.14 R1.2 | R1.2 R3.1
N$10  (via drill 0.35)
  Top 0.203: v58.63,83.55 59.95,82.23 v61.91,82.23
  Bottom 0.203: U13.2 64.77,82.23 64.45,81.92 TP13.1 63.5,81.92 63.18,82.23 v61.91,82.23 | R15.2 57.15,89.22 58.1,88.26 58.1,84.08 v58.63,83.55
N$11
  Bottom 0.203: U27.2 64.77,49.21 64.45,48.9 TP21.1 63.5,48.9 62.87,48.26 62.87,45.72 63.5,45.09 R14.2
N$12
  Bottom 0.203: U6.4 43.83,56.52 44.44,55.91 R7.1 C5.1 44.96,54.08 arc45 46.76,53.34 48.13,53.34 arc-45 49.67,52.7 arc-45 50.16,51.51 50.16,42.52 arc-45 49.42,40.72 U$1.C3
N$13
  Bottom 0.203: U26.4 13.97,46.34 13.37,45.73 R75.1 C96.1 9.96,45.73 J7.3
N$14  (via drill 0.35)
  Top 0.203: v61.59,73.66 60.96,73.66 v59.69,74.93 | v57.15,87.95 57.98,87.12 57.98,82.04 59.37,80.64 v59.37,79.38
  Bottom 0.203: U1.2 64.77,73.98 64.45,73.66 TP22.1 63.12,73.66 62.81,73.97 62.29,73.97 61.97,73.66 v61.59,73.66 | v59.69,74.93 58.42,76.2 58.42,78.42 v59.37,79.38 | R19.2 v57.15,87.95
N$15
  Bottom 0.203: R20.1 C22.1 63.5,68.26 64.14,68.9 U2.7
N$16  (via drill 0.35)
  other vias: 63.82,77.79
N$17
  Bottom 0.203: U29.4 13.97,39.99 13.37,39.38 R81.1 C103.1 12.06,40.64 10.54,42.16 J7.5
N$18
  Bottom 1.016: U$2.P$1 21,20 J8.1
N$20  (via drill 0.35)
  Top 0.203: U5.1 v60.72,22.84
  Bottom 0.203: R27.1 61.28,23 61.13,22.84 v60.72,22.84
N$22
  Bottom 0.203: R5.1 61.28,86.04 62.55,84.77 C51.1 63.56,84.77 64.19,85.41 U13.7
N$24
  Bottom 0.203: U1.7 64.15,77.15 63.52,76.52 C81.1 61.61,77.79 R10.1
N$25
  Bottom 0.203: R6.1 61.29,53.02 C95.1 63.49,51.75 64.12,52.39 U27.7
N$27
  Bottom 0.203: U8.4 31.13,56.52 31.73,55.91 R13.1 C8.1 31.73,51.87 arc45 32.48,50.07 36.19,46.36 arc45 37.98,45.62 U$1.C2
N$28
  Bottom 0.203: U8.3 34.72,57.47 35.41,58.16 35.41,62.68 33.96,64.14 R8.2 R9.1
N$29
  Bottom 0.203: U23.4 13.97,52.69 13.37,52.09 R66.1 C83.1 12.05,52.07 11.43,52.07 10.79,52.07 10.16,52.07 9.53,51.44 J7.1
N$30
  Bottom 0.203: U12.3 75.88,44.24 75.19,44.93 70.67,44.93 69.22,43.48 R43.2 R44.1
N$32
  Bottom 0.203: U3.3 43.07,77.47 42.38,76.78 42.38,72.25 43.83,70.8 R22.2 R23.1
N$38
  Bottom 0.152: J4.5 41.21,80.33 C25.1
  Bottom 0.203: C25.1 R40.1 39.7,79.03 40.31,78.42 U10.4
N$40
  Bottom 0.203: U9.3 54.41,14.29 55.09,14.98 55.09,19.5 53.64,20.95 R30.2 R35.1
N$41
  Bottom 0.203: U16.3 49.42,77.47 48.73,76.78 48.73,72.25 50.18,70.8 R32.2 R33.1
N$42
  Bottom 0.203: U11.4 37.48,56.52 38.09,55.91 R42.1 C18.1 38.1,53.98 arc90 38.73,53.34 42.21,53.34 arc-45 44.01,52.6 44.88,51.72 arc45 46.68,50.98 U$1.C1
N$43
  Bottom 0.203: U11.3 41.07,57.47 41.76,58.16 41.76,62.68 40.31,64.14 R37.2 R41.1
N$44
  Bottom 0.152: J4.3 46.05,81.17 C40.1
  Bottom 0.203: C40.1 R24.1 46.05,79.03 46.66,78.42 U3.4
N$46
  Bottom 0.152: J4.1 52.39,80.33 C53.1
  Bottom 0.203: C53.1 R34.1 52.4,79.03 53.01,78.42 U16.4
N$49
  Bottom 0.203: U9.4 50.81,13.34 51.42,12.73 R36.1 C11.1 50.55,11.43 J5.5
N$50  (via drill 0.35)
  Top 0.203: v73.72,83.5 73.98,83.5 75.84,81.64 76.98,81.64 78.14,80.47 78.14,77.47 79.83,75.79 84.12,75.79 v85.61,74.3
  Bottom 0.203: R12.2 v85.61,74.3 | U13.13 73.98,83.5 73.97,83.5 v73.72,83.5
N$51  (via drill 0.35)
  Top 0.203: v77.79,60.33 77.79,59.37 77.15,58.74 v73.33,58.74 v73.33,58.73
  Bottom 0.203: R16.2 85.09,69.22 83.19,67.31 83.19,63.5 81.92,62.23 79.69,62.23 v77.79,60.33 | v73.33,58.73 U25.13
N$52  (via drill 0.35)
  Top 0.203: v77.54,50.8 77.23,50.48 v73.03,50.48
  Bottom 0.203: R18.2 83.82,65.27 83.82,59.05 78.11,53.34 78.11,51.44 77.47,50.8 v77.54,50.8 | v73.03,50.48 U27.13
N$53  (via drill 0.35)
  Top 0.203: v73.33,75.25 v77.15,75.25
  Bottom 0.203: v77.15,75.25 83.08,75.25 85.3,73.03 R21.2 | v73.33,75.25 U1.13
N$54
  Bottom 0.203: U19.3 75.88,37.9 75.19,38.58 70.67,38.58 69.22,37.13 R50.2 R51.1
N$55
  Bottom 0.203: U14.4 44.47,13.34 45.07,12.73 R54.1 C28.1 45.07,9.96 J5.3
N$57
  Bottom 0.203: U17.4 38.12,13.34 38.72,12.73 R73.1 C37.1 40.62,9.53 J5.1
N$60
  Bottom 0.203: U14.3 48.05,14.29 48.74,14.98 48.74,19.5 47.29,20.95 R49.2 R53.1
N$61
  Bottom 0.203: U21.3 75.88,31.55 75.19,32.23 70.67,32.23 69.22,30.78 R58.2 R59.1
N$65
  Bottom 0.203: U21.4 76.83,27.95 77.44,28.56 R60.1 C67.1 78.75,28.57 80.64,28.57 81.28,29.21 J6.1
N$67
  Bottom 0.203: J2.6 84.01,71.75 R25.1
N$69
  Bottom 0.203: U23.3 14.93,49.1 15.61,48.41 20.14,48.41 21.59,49.86 R64.2 R65.1
N$71
  Bottom 0.203: U17.3 41.7,14.29 42.39,14.98 42.39,19.5 40.94,20.95 R71.2 R72.1
N$74
  Bottom 0.203: U26.3 14.93,42.75 15.61,42.06 20.14,42.06 21.59,43.51 R70.2 R74.1
N$78
  Bottom 0.203: U29.3 14.93,36.4 15.61,35.71 20.14,35.71 21.59,37.16 R79.2 R80.1
TEMP_EXT  (via drill 0.35)
  Top 0.203: U5.3 59.32,24.71 59.37,24.77 v59.37,25.72
  Bottom 0.203: U25.2 64.77,57.47 64.45,57.15 TP17.1 63.17,57.15 62.85,57.47 60.83,57.47 57.78,54.42 57.78,33.97 59.37,32.38 v59.37,25.72
TEMP_INT
  Bottom 0.203: U2.2 TP1.1 56.51,63.18 50.8,63.18 49.53,61.91 49.53,60.64 50.15,60.02 U4.3
UCB0_SPI_CLK  (via drill 0.35)
  Top 0.203: J2.7 79.09,67.66 78.13,66.7 v78.13,65.4
  Bottom 0.203: U13.16 69.85,81.6 69.53,81.28 69.53,73.34 | U1.16 69.53,73.34 | 69.53,65.09 69.53,71.77 69.49,71.81 69.49,72.33 69.53,72.38 69.53,73.34 | 69.53,65.09 U2.16 | 69.53,65.09 69.53,56.83 | 69.53,56.83 U25.16 | 69.53,56.83 69.53,48.9 69.85,48.58 U27.16 75.19,48.58 75.56,48.95 75.56,49.53 76.56,50.52 76.56,60.49 78.13,62.06 v78.13,65.4
UCB0_SPI_MISO  (via drill 0.35)
  Top 0.203: v73.98,68.26 v75.25,68.26 | v73.98,59.37 v75.25,59.37 | v75.25,51.12 v73.98,51.12 | v73.98,75.88 v75.25,75.88 | v76.2,64.14 79.44,64.14 J2.11
  Bottom 0.203: v73.98,75.88 U1.12 | U2.12 72.39,67.63 73.03,68.26 v73.98,68.26 | v75.25,68.26 76.2,68.26 | v73.98,59.37 U25.12 | v73.98,51.12 U27.12 | v75.25,75.88 76.2,75.88 | 76.2,68.26 v76.2,64.14 76.2,59.37 | v75.25,59.37 76.2,59.37 | U13.12 73.98,84.14 76.2,81.92 76.2,75.88 | 76.2,59.37 76.2,52.07 v75.25,51.12 | 76.2,75.88 76.2,68.26
UCB0_SPI_MOSI  (via drill 0.35)
  Top 0.203: J2.9 79.03,64.77 v74.61,64.77
  Bottom 0.203: U1.14 74.61,74.61 | U27.14 73.66,49.85 74.61,50.8 74.61,58.1 | 74.61,58.1 v74.61,64.77 | v74.61,64.77 74.61,74.61 | U25.14 74.61,58.1 | U13.14 73.66,82.87 74.61,81.92 74.61,74.61 | v74.61,64.77 74.61,66.04 72.71,66.04 72.39,66.36 U2.14
X+_0_DEGREES
  Bottom 0.203: U9.1 53.02,16.19 52.39,15.55 52.39,15.24 | 52.39,15.24 52.39,14.05 52.72,13.72 R36.2 C11.2 | U25.3 60.96,58.1 57.31,54.45 57.31,33.5 49.21,25.4 TP14.1 49.21,19.64 49.21,19.63 49.21,16.2 50.16,15.24 52.39,15.24
X+_120_DEGREES
  Bottom 0.203: U25.4 61.09,58.74 56.95,54.6 56.95,33.64 48.83,25.52 44.57,25.52 TP16.1 42.86,19.64 42.86,19.63 42.86,16.52 44.13,15.24 46.04,15.24 | U14.1 46.67,16.19 46.04,15.55 46.04,15.24 | 46.04,15.24 46.04,14.05 46.37,13.72 R54.2 C28.2
X+_240_DEGREES
  Bottom 0.203: U25.5 64.77,59.37 64.57,59.17 61.02,59.17 56.6,54.75 56.6,33.79 48.68,25.88 38.26,25.88 TP25.1 36.2,16.51 37.47,15.24 39.69,15.24 | U17.1 40.32,16.19 39.69,15.55 39.69,15.24 | 39.69,15.24 39.69,14.05 40.02,13.72 R73.2 C37.2
X-_0_DEGREES
  Bottom 0.203: U10.1 38.1,75.57 38.73,76.2 38.73,76.52 | 38.73,76.52 38.73,77.7 38.4,78.03 R40.2 C25.2 | 38.73,76.52 40.53,76.52 42.02,75.02 42.02,71.1 44.65,68.47 53.68,68.47 57.78,72.58 TP10.1 57.78,80.59 60.06,82.87 U13.3
X-_120_DEGREES
  Bottom 0.203: U3.1 44.45,75.57 45.09,76.2 45.09,76.52 | 45.09,76.52 45.09,77.7 44.75,78.03 R24.2 C40.2 | 45.09,76.52 46.88,76.52 48.37,75.02 48.37,71.1 50.65,68.83 53.53,68.83 56.52,71.81 TP5.1 56.52,79.83 60.19,83.5 U13.4
X-_240_DEGREES
  Bottom 0.203: U13.5 64.14,84.14 64.07,84.07 60.26,84.07 55.56,79.38 TP9.1 55.56,77.47 54.61,76.52 51.44,76.52 | U16.1 50.8,75.57 51.44,76.2 51.44,76.52 | 51.44,76.52 51.44,77.7 51.1,78.03 R34.2 C53.2
Y+_0_DEGREES
  Bottom 0.203: U27.3 63.18,49.85 62.2,48.86 62.2,43.85 TP11.1 67.11,38.94 73.86,38.94 74.93,40.01 74.93,42.23 | U12.1 73.98,42.86 74.61,42.23 74.93,42.23 | 74.93,42.23 76.11,42.23 76.45,42.56 R45.2 C34.2
Y+_120_DEGREES
  Bottom 0.203: U19.1 73.98,36.51 74.61,35.88 74.93,35.88 | 74.93,35.88 76.11,35.88 76.45,36.21 R52.2 C59.2 | 74.93,35.88 74.93,33.86 73.66,32.59 68.43,32.59 65.72,35.3 TP15.1 65.72,38.1 64.77,39.05 64.77,40.77 61.84,43.7 61.84,49.01 63.31,50.48 U27.4
Y+_240_DEGREES
  Bottom 0.203: U27.5 63.45,51.12 61.49,49.16 61.49,43.55 64.41,40.62 64.41,33.69 65.72,32.38 TP19.1 65.72,28.57 67.94,26.35 73.97,26.35 74.93,27.3 74.93,29.53 | U21.1 73.98,30.16 74.61,29.53 74.93,29.53 | 74.93,29.53 76.11,29.53 76.45,29.86 R60.2 C67.2
Y-_0_DEGREES
  Bottom 0.203: U29.1 16.82,37.78 16.19,38.42 15.88,38.42 | 15.88,38.42 14.69,38.42 14.36,38.09 R81.2 C103.2 | 15.88,38.42 15.88,40.64 16.83,41.59 19.73,41.59 19.74,41.6 20.26,41.6 20.27,41.59 TP29.1 25.91,42.74 25.91,63.19 30.13,67.41 54.4,67.41 61.61,74.61 U1.3
Y-_120_DEGREES
  Bottom 0.203: 15.88,44.77 14.69,44.77 14.36,44.44 R75.2 C96.2 | 15.88,44.77 16.19,44.77 16.82,44.13 U26.1 | 15.88,44.77 15.88,46.99 16.83,47.95 20.26,47.95 20.27,47.94 TP27.1 25.56,48.73 25.56,63.33 29.98,67.76 54.26,67.76 61.74,75.25 U1.4
Y-_240_DEGREES
  Bottom 0.203: U23.1 16.82,50.48 16.19,51.12 15.88,51.12 | 15.88,51.12 14.69,51.12 14.36,50.78 R66.2 C83.2 | 15.88,51.12 15.88,53.34 16.83,54.3 TP23.1 | U1.5 64.14,75.88 63.86,75.6 61.59,75.6 54.11,68.12 29.84,68.12 25.2,63.48 25.2,54.73 24.92,54.45 TP23.1 | TP23.1

### Text on the board
tPlace: Z MINUS SUN SENSE BOARD REV B | LORIS CubeSat ADCS Subsystem | Designed by: T. Christison | TOP SIDE
bPlace: +3V3 | GND | Z MINUS SUN SENSE BOARD REV B | LORIS CubeSat ADCS Subsystem | Designed by: T. Christison | BOTTOM SIDE
bNames: C72 | C90